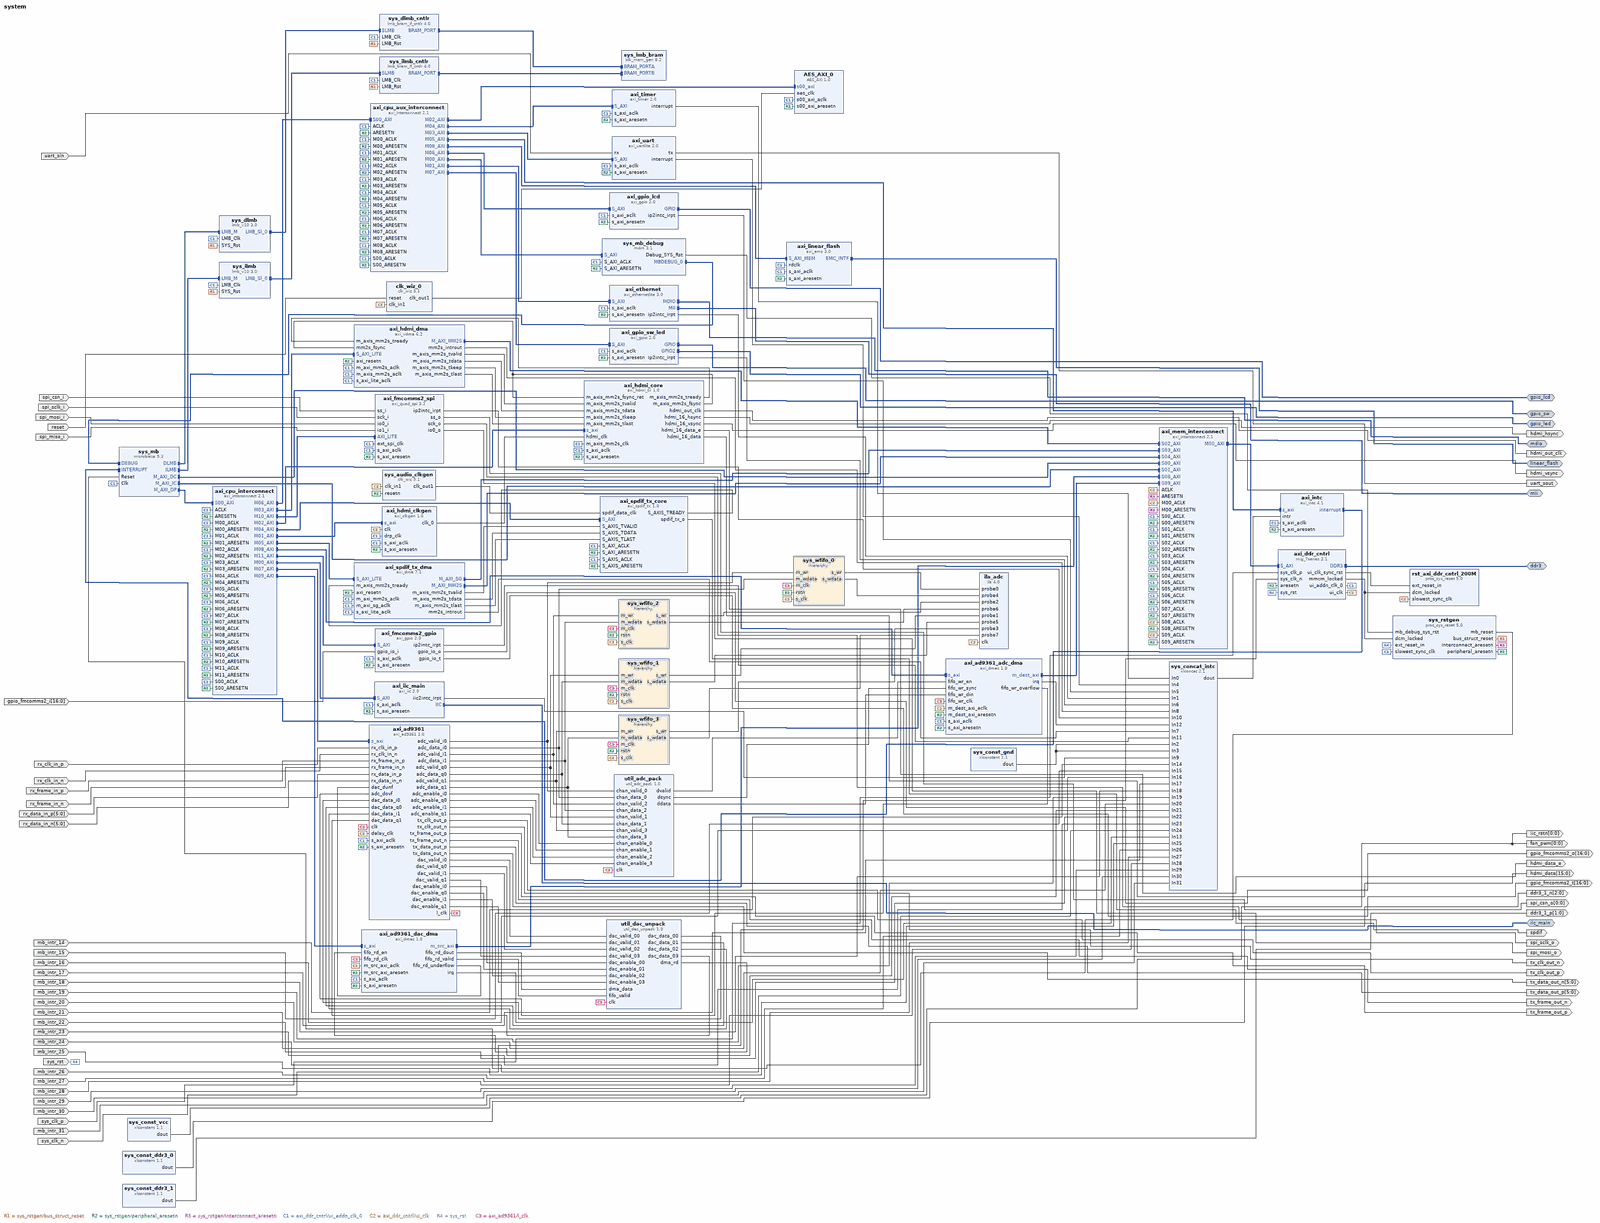
[diagram p0: block diagram of the top level, whole]
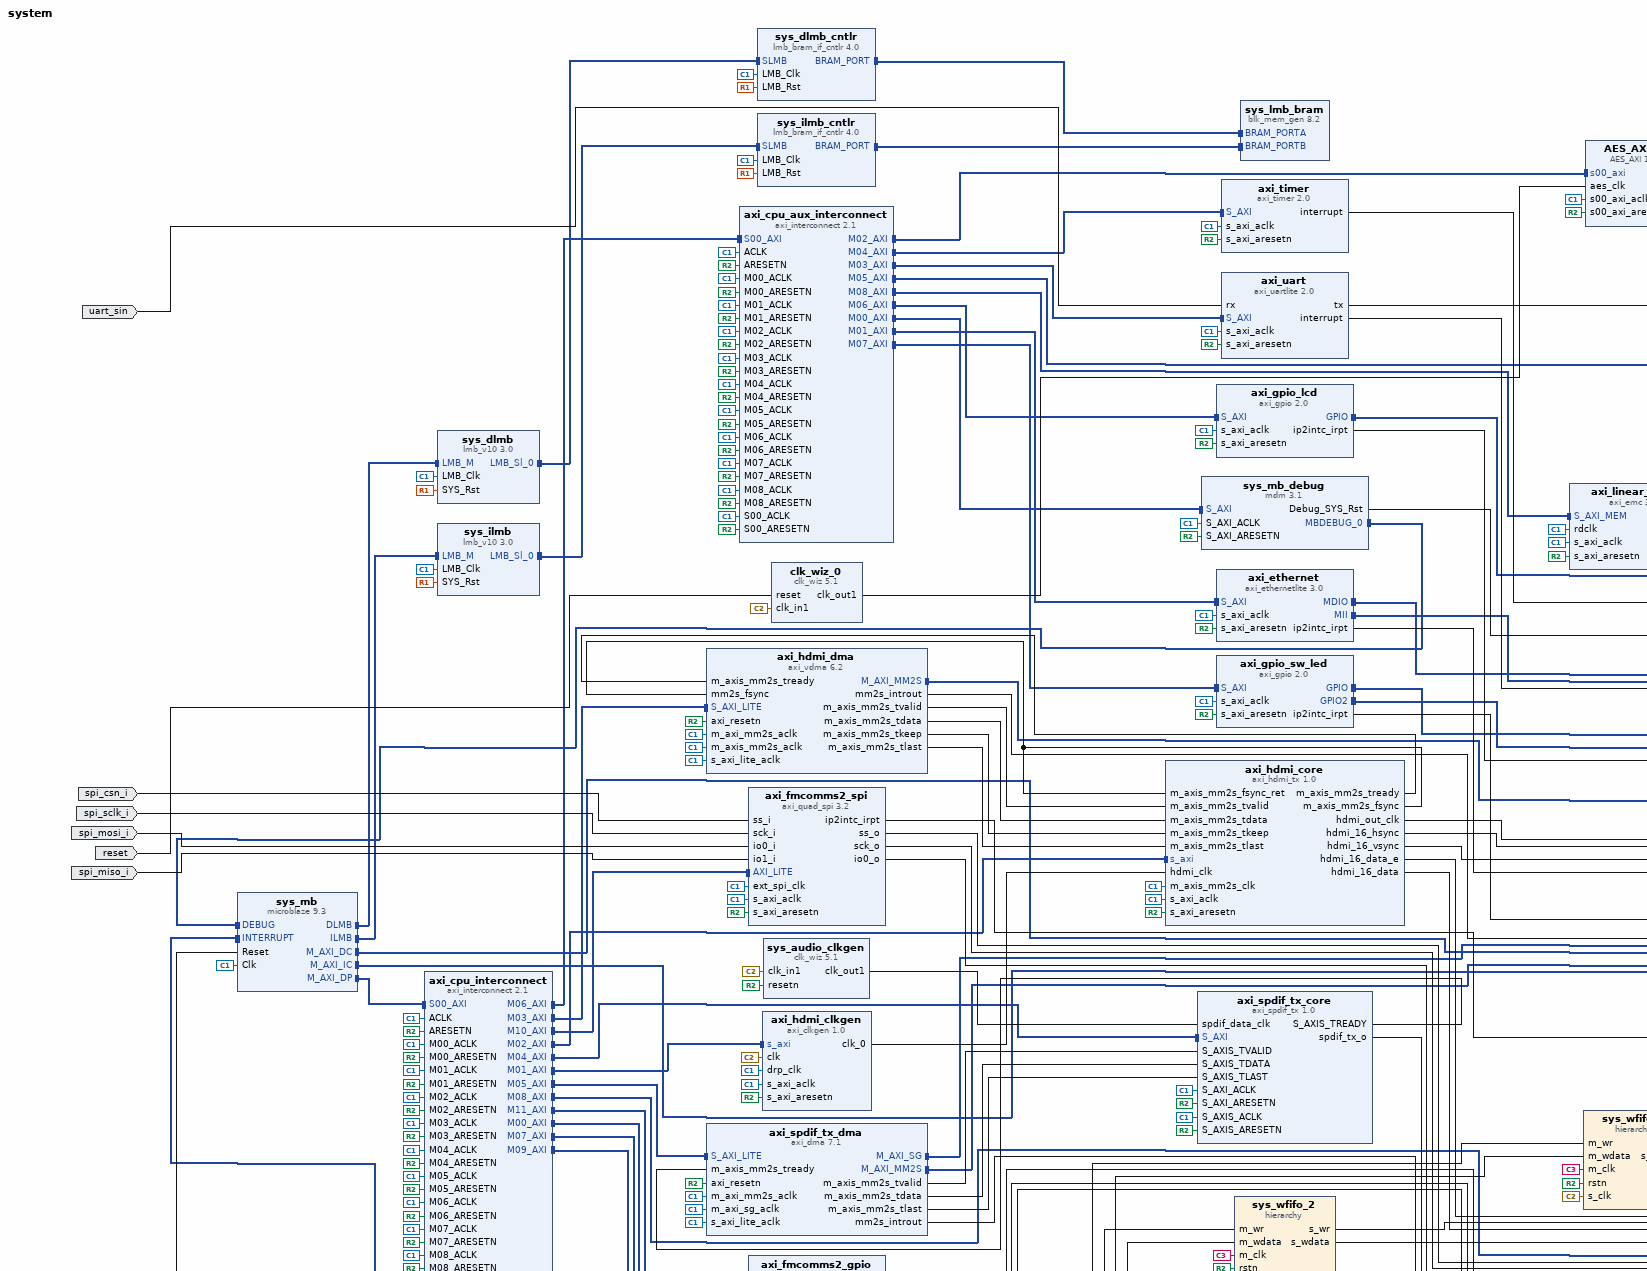
[diagram p1: block diagram of the top level, upper left part]
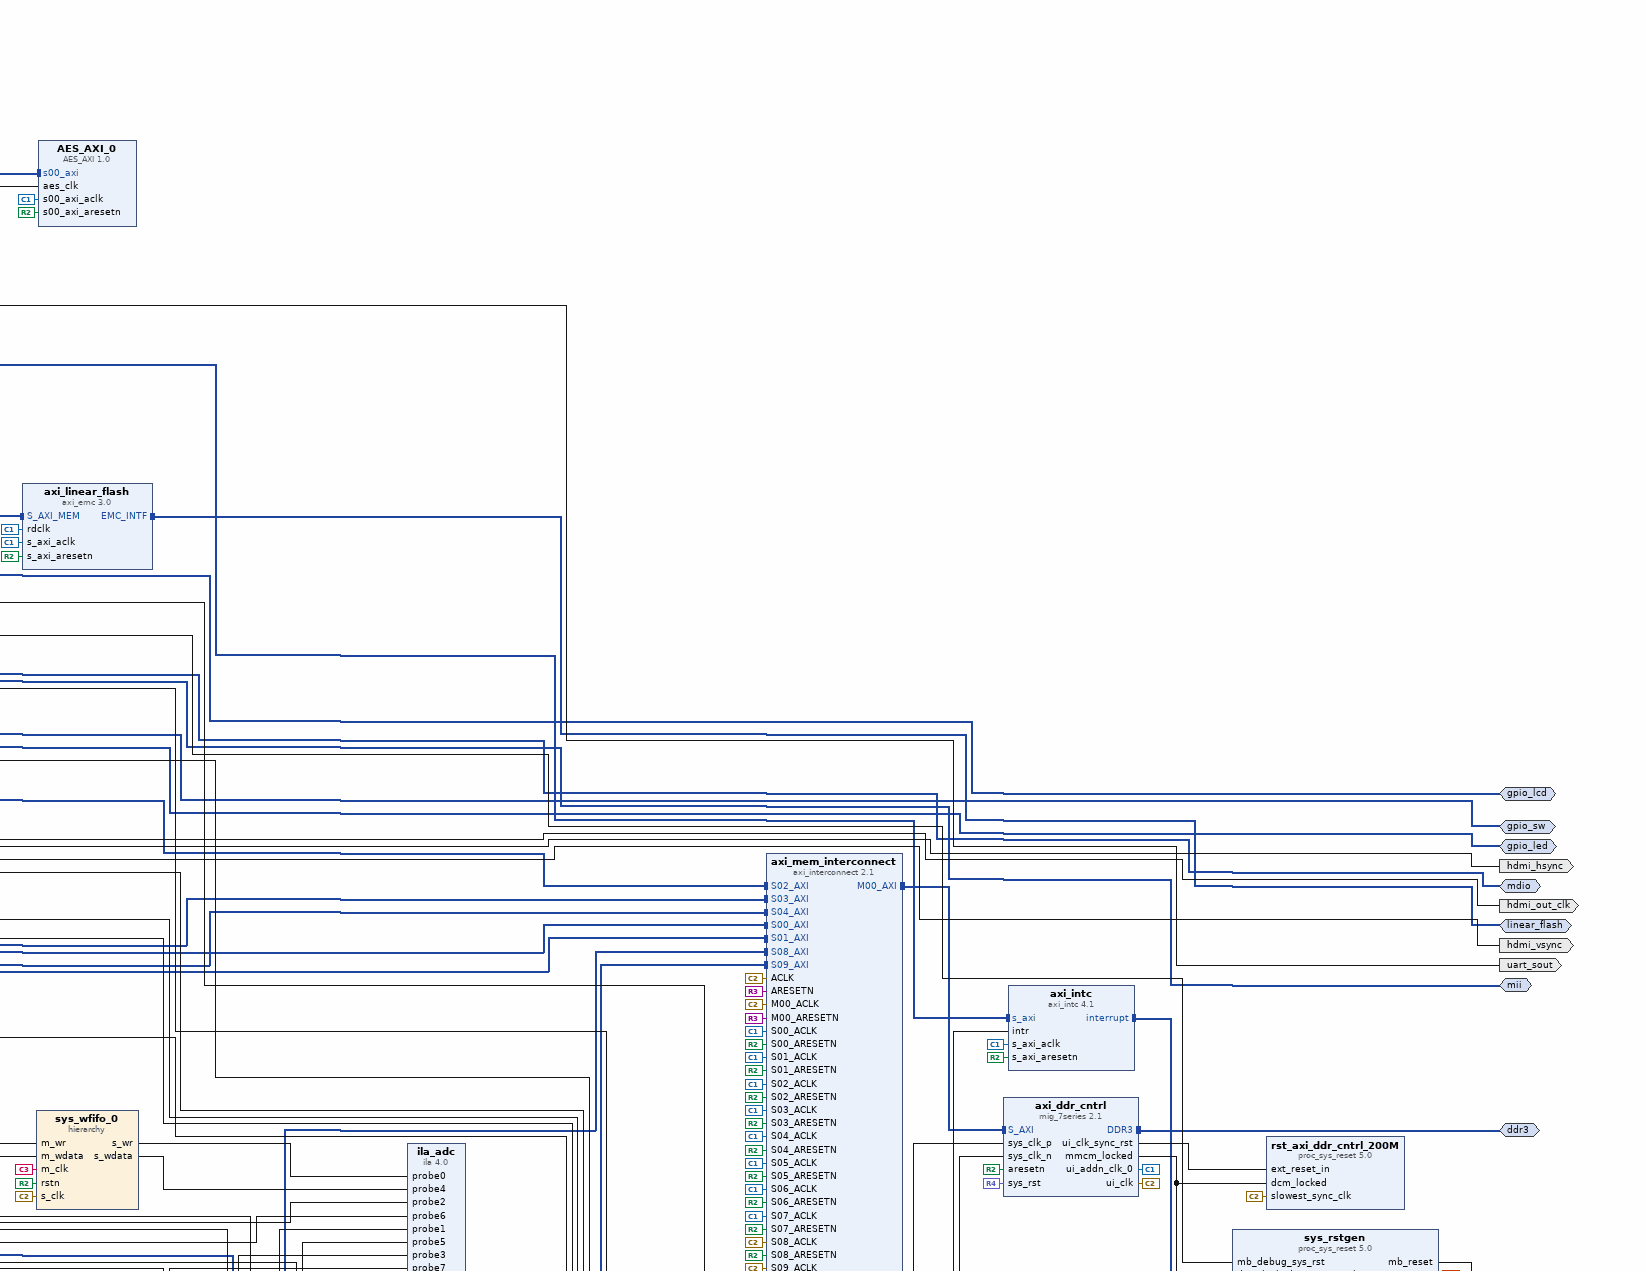
[diagram p2: block diagram of the top level, upper right part]
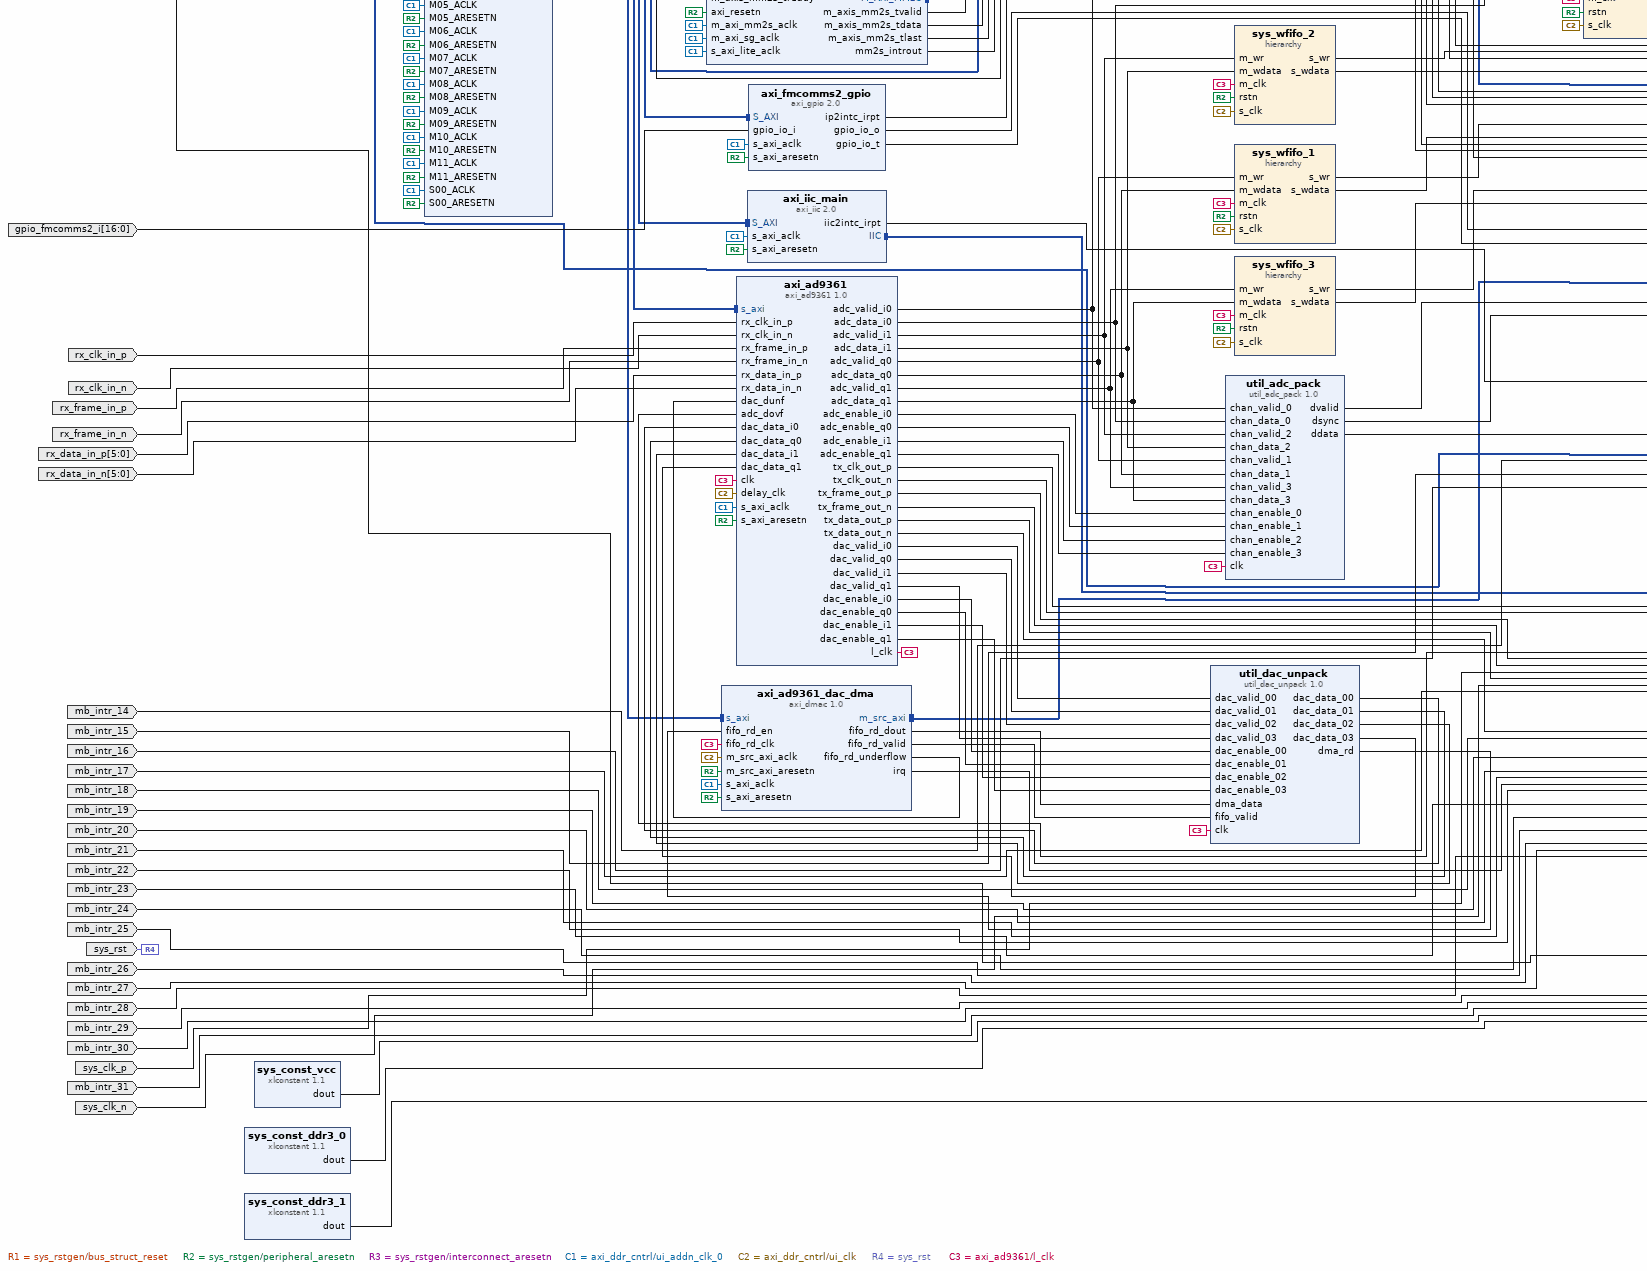
[diagram p3: block diagram of the top level, lower left part]
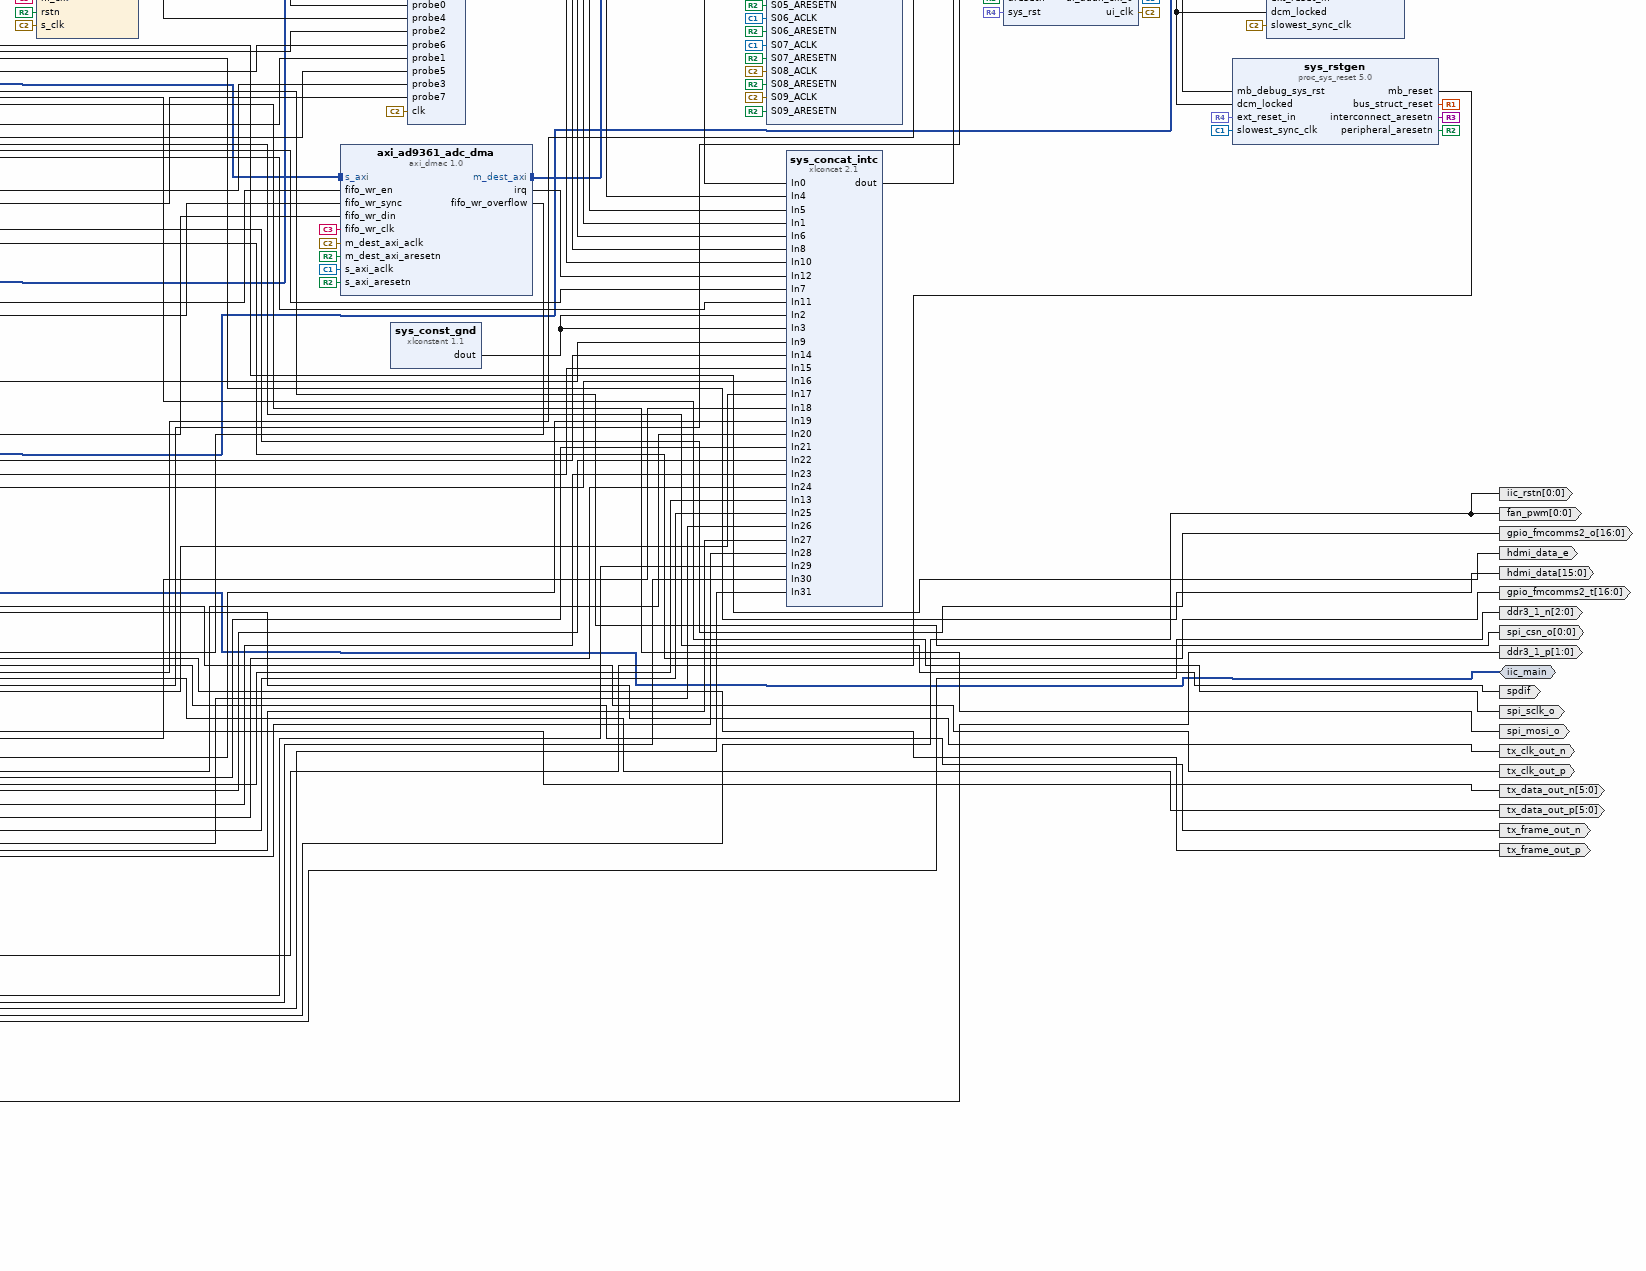
[diagram p4: block diagram of the top level, lower right part]
# Vivado block design system, Vivado 2014.2
create_bd_design system

create_bd_intf_port -mode Master -vlnv xilinx.com:interface:ddrx_rtl:1.0 ddr3
create_bd_intf_port -mode Master -vlnv xilinx.com:interface:mdio_rtl:1.0 mdio
create_bd_intf_port -mode Master -vlnv xilinx.com:interface:mii_rtl:1.0 mii
create_bd_intf_port -mode Master -vlnv xilinx.com:interface:gpio_rtl:1.0 gpio_sw
create_bd_intf_port -mode Master -vlnv xilinx.com:interface:gpio_rtl:1.0 gpio_led
create_bd_intf_port -mode Master -vlnv xilinx.com:interface:gpio_rtl:1.0 gpio_lcd
create_bd_intf_port -mode Master -vlnv xilinx.com:interface:iic_rtl:1.0 iic_main
create_bd_intf_port -mode Master -vlnv xilinx.com:interface:emc_rtl:1.0 linear_flash
create_bd_port -dir I -type intr mb_intr_14
create_bd_port -dir I -type intr mb_intr_15
create_bd_port -dir I -type intr mb_intr_16
create_bd_port -dir I -type intr mb_intr_17
create_bd_port -dir I -type intr mb_intr_18
create_bd_port -dir I -type intr mb_intr_19
create_bd_port -dir I -type intr mb_intr_20
create_bd_port -dir I -type intr mb_intr_21
create_bd_port -dir I -type intr mb_intr_22
create_bd_port -dir I -type intr mb_intr_23
create_bd_port -dir I -type intr mb_intr_24
create_bd_port -dir I -type intr mb_intr_25
create_bd_port -dir I -type intr mb_intr_26
create_bd_port -dir I -type intr mb_intr_27
create_bd_port -dir I -type intr mb_intr_28
create_bd_port -dir I -type intr mb_intr_29
create_bd_port -dir I -type intr mb_intr_30
create_bd_port -dir I -type intr mb_intr_31
create_bd_port -dir O -from 0 -to 0 iic_rstn
create_bd_port -dir O -from 0 -to 0 fan_pwm
create_bd_port -dir I -type rst sys_rst
set_property -dict {CONFIG.POLARITY ACTIVE_HIGH} [get_bd_ports sys_rst]
create_bd_port -dir I sys_clk_p
create_bd_port -dir I sys_clk_n
create_bd_port -dir O -from 2 -to 0 ddr3_1_n
create_bd_port -dir O -from 1 -to 0 ddr3_1_p
create_bd_port -dir I uart_sin
create_bd_port -dir O uart_sout
create_bd_port -dir O hdmi_out_clk
create_bd_port -dir O hdmi_hsync
create_bd_port -dir O hdmi_vsync
create_bd_port -dir O hdmi_data_e
create_bd_port -dir O -from 15 -to 0 hdmi_data
create_bd_port -dir O spdif
create_bd_port -dir I spi_csn_i
create_bd_port -dir O -from 0 -to 0 spi_csn_o
create_bd_port -dir I spi_sclk_i
create_bd_port -dir O spi_sclk_o
create_bd_port -dir I spi_mosi_i
create_bd_port -dir O spi_mosi_o
create_bd_port -dir I spi_miso_i
create_bd_port -dir I -from 16 -to 0 gpio_fmcomms2_i
create_bd_port -dir O -from 16 -to 0 gpio_fmcomms2_o
create_bd_port -dir O -from 16 -to 0 gpio_fmcomms2_t
create_bd_port -dir I rx_clk_in_p
create_bd_port -dir I rx_clk_in_n
create_bd_port -dir I rx_frame_in_p
create_bd_port -dir I rx_frame_in_n
create_bd_port -dir I -from 5 -to 0 rx_data_in_p
create_bd_port -dir I -from 5 -to 0 rx_data_in_n
create_bd_port -dir O tx_clk_out_p
create_bd_port -dir O tx_clk_out_n
create_bd_port -dir O tx_frame_out_p
create_bd_port -dir O tx_frame_out_n
create_bd_port -dir O -from 5 -to 0 tx_data_out_p
create_bd_port -dir O -from 5 -to 0 tx_data_out_n
create_bd_port -dir I -type rst reset
set_property -dict {CONFIG.POLARITY ACTIVE_HIGH} [get_bd_ports reset]

create_bd_cell -type ip -vlnv xilinx.com:ip:microblaze:9.3 sys_mb
set_property -dict {CONFIG.G_TEMPLATE_LIST 4} [get_bd_cells sys_mb]
create_bd_cell -type ip -vlnv xilinx.com:ip:lmb_v10:3.0 sys_dlmb
create_bd_cell -type ip -vlnv xilinx.com:ip:lmb_v10:3.0 sys_ilmb
create_bd_cell -type ip -vlnv xilinx.com:ip:lmb_bram_if_cntlr:4.0 sys_dlmb_cntlr
set_property -dict {CONFIG.C_ECC 0} [get_bd_cells sys_dlmb_cntlr]
create_bd_cell -type ip -vlnv xilinx.com:ip:lmb_bram_if_cntlr:4.0 sys_ilmb_cntlr
set_property -dict {CONFIG.C_ECC 0} [get_bd_cells sys_ilmb_cntlr]
create_bd_cell -type ip -vlnv xilinx.com:ip:blk_mem_gen:8.2 sys_lmb_bram
set_property -dict {CONFIG.Memory_Type True_Dual_Port_RAM CONFIG.use_bram_block BRAM_Controller} [get_bd_cells sys_lmb_bram]
create_bd_cell -type ip -vlnv xilinx.com:ip:mdm:3.1 sys_mb_debug
set_property -dict {CONFIG.C_USE_UART 1} [get_bd_cells sys_mb_debug]
create_bd_cell -type ip -vlnv xilinx.com:ip:proc_sys_reset:5.0 sys_rstgen
create_bd_cell -type ip -vlnv xilinx.com:ip:xlconstant:1.1 sys_const_vcc
create_bd_cell -type ip -vlnv xilinx.com:ip:xlconstant:1.1 sys_const_gnd
set_property -dict {CONFIG.CONST_VAL 0} [get_bd_cells sys_const_gnd]
create_bd_cell -type ip -vlnv xilinx.com:ip:mig_7series:2.1 axi_ddr_cntrl
set_property -dict {CONFIG.XML_INPUT_FILE kc705_system_mig.prj} [get_bd_cells axi_ddr_cntrl]
create_bd_cell -type ip -vlnv xilinx.com:ip:xlconstant:1.1 sys_const_ddr3_0
set_property -dict {CONFIG.CONST_WIDTH 3 CONFIG.CONST_VAL 0} [get_bd_cells sys_const_ddr3_0]
create_bd_cell -type ip -vlnv xilinx.com:ip:xlconstant:1.1 sys_const_ddr3_1
set_property -dict {CONFIG.CONST_WIDTH 2 CONFIG.CONST_VAL 1} [get_bd_cells sys_const_ddr3_1]
create_bd_cell -type ip -vlnv xilinx.com:ip:axi_interconnect:2.1 axi_cpu_aux_interconnect
set_property -dict {CONFIG.NUM_MI 9 CONFIG.STRATEGY 1} [get_bd_cells axi_cpu_aux_interconnect]
create_bd_cell -type ip -vlnv xilinx.com:ip:axi_interconnect:2.1 axi_cpu_interconnect
set_property -dict {CONFIG.NUM_MI 12 CONFIG.STRATEGY 1} [get_bd_cells axi_cpu_interconnect]
create_bd_cell -type ip -vlnv xilinx.com:ip:axi_interconnect:2.1 axi_mem_interconnect
set_property -dict [list \
  CONFIG.NUM_SI 10 \
  CONFIG.NUM_MI 1 \
  CONFIG.STRATEGY 2 \
  CONFIG.ENABLE_ADVANCED_OPTIONS 1 \
  CONFIG.XBAR_DATA_WIDTH 512 \
] [get_bd_cells axi_mem_interconnect]
create_bd_cell -type ip -vlnv xilinx.com:ip:axi_ethernetlite:3.0 axi_ethernet
set_property -dict [list \
  CONFIG.USE_BOARD_FLOW true \
  CONFIG.MII_BOARD_INTERFACE mii \
  CONFIG.MDIO_BOARD_INTERFACE mdio_mdc \
] [get_bd_cells axi_ethernet]
create_bd_cell -type ip -vlnv xilinx.com:ip:axi_iic:2.0 axi_iic_main
create_bd_cell -type ip -vlnv xilinx.com:ip:axi_uartlite:2.0 axi_uart
set_property -dict {CONFIG.C_BAUDRATE 115200} [get_bd_cells axi_uart]
create_bd_cell -type ip -vlnv xilinx.com:ip:axi_timer:2.0 axi_timer
create_bd_cell -type ip -vlnv xilinx.com:ip:axi_gpio:2.0 axi_gpio_lcd
set_property -dict {CONFIG.C_GPIO_WIDTH 7 CONFIG.C_INTERRUPT_PRESENT 1} [get_bd_cells axi_gpio_lcd]
create_bd_cell -type ip -vlnv xilinx.com:ip:axi_gpio:2.0 axi_gpio_sw_led
set_property -dict [list \
  CONFIG.C_GPIO_WIDTH 9 \
  CONFIG.C_GPIO2_WIDTH 8 \
  CONFIG.C_IS_DUAL 1 \
  CONFIG.C_INTERRUPT_PRESENT 1 \
] [get_bd_cells axi_gpio_sw_led]
create_bd_cell -type ip -vlnv xilinx.com:ip:axi_intc:4.1 axi_intc
set_property -dict {CONFIG.C_HAS_FAST 0} [get_bd_cells axi_intc]
create_bd_cell -type ip -vlnv xilinx.com:ip:xlconcat:2.1 sys_concat_intc
set_property -dict {CONFIG.NUM_PORTS 32} [get_bd_cells sys_concat_intc]
create_bd_cell -type ip -vlnv analog.com:user:axi_clkgen:1.0 axi_hdmi_clkgen
create_bd_cell -type ip -vlnv analog.com:user:axi_hdmi_tx:1.0 axi_hdmi_core
create_bd_cell -type ip -vlnv xilinx.com:ip:axi_vdma:6.2 axi_hdmi_dma
set_property -dict [list \
  CONFIG.c_m_axis_mm2s_tdata_width 64 \
  CONFIG.c_use_mm2s_fsync 1 \
  CONFIG.c_include_s2mm 0 \
] [get_bd_cells axi_hdmi_dma]
create_bd_cell -type ip -vlnv xilinx.com:ip:clk_wiz:5.1 sys_audio_clkgen
set_property -dict [list \
  CONFIG.PRIM_IN_FREQ 200.000 \
  CONFIG.CLKOUT1_REQUESTED_OUT_FREQ 12.288 \
  CONFIG.USE_LOCKED false \
  CONFIG.USE_RESET true \
  CONFIG.RESET_TYPE ACTIVE_LOW \
] [get_bd_cells sys_audio_clkgen]
create_bd_cell -type ip -vlnv analog.com:user:axi_spdif_tx:1.0 axi_spdif_tx_core
set_property -dict {CONFIG.C_DMA_TYPE 0 CONFIG.C_S_AXI_ADDR_WIDTH 16} [get_bd_cells axi_spdif_tx_core]
create_bd_cell -type ip -vlnv xilinx.com:ip:axi_dma:7.1 axi_spdif_tx_dma
set_property -dict {CONFIG.c_sg_include_stscntrl_strm 0 CONFIG.c_include_s2mm 0} [get_bd_cells axi_spdif_tx_dma]
create_bd_cell -type ip -vlnv xilinx.com:ip:axi_emc:3.0 axi_linear_flash
set_property -dict [list \
  CONFIG.C_WR_REC_TIME_MEM_0 0 \
  CONFIG.C_TLZWE_PS_MEM_0 0 \
  CONFIG.C_TWPH_PS_MEM_0 20000 \
  CONFIG.C_TWP_PS_MEM_0 50000 \
  CONFIG.C_TWC_PS_MEM_0 19000 \
  CONFIG.C_THZOE_PS_MEM_0 15000 \
  CONFIG.C_THZCE_PS_MEM_0 20000 \
  CONFIG.C_TPACC_PS_FLASH_0 25000 \
  CONFIG.C_TAVDV_PS_MEM_0 100000 \
  CONFIG.C_TCEDV_PS_MEM_0 100000 \
  CONFIG.C_MEM0_TYPE 2 \
  CONFIG.C_S_AXI_MEM_ID_WIDTH 0 \
  CONFIG.USE_BOARD_FLOW true \
  CONFIG.EMC_BOARD_INTERFACE linear_flash \
] [get_bd_cells axi_linear_flash]
create_bd_cell -type ip -vlnv analog.com:user:axi_ad9361:1.0 axi_ad9361
set_property -dict {CONFIG.PCORE_ID 0} [get_bd_cells axi_ad9361]
create_bd_cell -type ip -vlnv analog.com:user:axi_dmac:1.0 axi_ad9361_dac_dma
set_property -dict [list \
  CONFIG.C_DMA_TYPE_SRC 0 \
  CONFIG.C_DMA_TYPE_DEST 2 \
  CONFIG.C_CYCLIC 1 \
  CONFIG.C_SYNC_TRANSFER_START 0 \
  CONFIG.C_AXI_SLICE_SRC 0 \
  CONFIG.C_AXI_SLICE_DEST 1 \
  CONFIG.C_CLKS_ASYNC_DEST_REQ 1 \
  CONFIG.C_CLKS_ASYNC_SRC_DEST 1 \
  CONFIG.C_CLKS_ASYNC_REQ_SRC 1 \
  CONFIG.C_2D_TRANSFER 0 \
  CONFIG.C_DMA_DATA_WIDTH_DEST 64 \
] [get_bd_cells axi_ad9361_dac_dma]
create_bd_cell -type ip -vlnv analog.com:user:util_adc_pack:1.0 util_adc_pack
set_property -dict {CONFIG.CHANNELS 4} [get_bd_cells util_adc_pack]
create_bd_cell -type ip -vlnv analog.com:user:util_dac_unpack:1.0 util_dac_unpack
set_property -dict {CONFIG.CHANNELS 4} [get_bd_cells util_dac_unpack]
create_bd_cell -type ip -vlnv analog.com:user:axi_dmac:1.0 axi_ad9361_adc_dma
set_property -dict [list \
  CONFIG.C_DMA_TYPE_SRC 2 \
  CONFIG.C_DMA_TYPE_DEST 0 \
  CONFIG.C_CYCLIC 0 \
  CONFIG.C_SYNC_TRANSFER_START 1 \
  CONFIG.C_AXI_SLICE_SRC 0 \
  CONFIG.C_AXI_SLICE_DEST 0 \
  CONFIG.C_CLKS_ASYNC_DEST_REQ 1 \
  CONFIG.C_CLKS_ASYNC_SRC_DEST 1 \
  CONFIG.C_CLKS_ASYNC_REQ_SRC 1 \
  CONFIG.C_2D_TRANSFER 0 \
  CONFIG.C_DMA_DATA_WIDTH_SRC 64 \
] [get_bd_cells axi_ad9361_adc_dma]
create_bd_cell -type ip -vlnv xilinx.com:ip:axi_quad_spi:3.2 axi_fmcomms2_spi
set_property -dict {CONFIG.C_USE_STARTUP 0 CONFIG.C_NUM_SS_BITS 1 CONFIG.C_SCK_RATIO 8} [get_bd_cells axi_fmcomms2_spi]
create_bd_cell -type ip -vlnv xilinx.com:ip:axi_gpio:2.0 axi_fmcomms2_gpio
set_property -dict {CONFIG.C_GPIO_WIDTH 17 CONFIG.C_IS_DUAL 0 CONFIG.C_INTERRUPT_PRESENT 1} [get_bd_cells axi_fmcomms2_gpio]
create_bd_cell -type ip -vlnv xilinx.com:ip:ila:4.0 ila_adc
set_property -dict [list \
  CONFIG.C_PROBE7_WIDTH 16 \
  CONFIG.C_PROBE6_WIDTH 16 \
  CONFIG.C_PROBE5_WIDTH 16 \
  CONFIG.C_PROBE4_WIDTH 16 \
  CONFIG.C_PROBE3_WIDTH 1 \
  CONFIG.C_PROBE2_WIDTH 1 \
  CONFIG.C_PROBE1_WIDTH 1 \
  CONFIG.C_PROBE0_WIDTH 1 \
  CONFIG.C_NUM_OF_PROBES 8 \
  CONFIG.C_EN_STRG_QUAL 1 \
  CONFIG.C_TRIGIN_EN false \
  CONFIG.C_MONITOR_TYPE Native \
] [get_bd_cells ila_adc]
create_bd_cell -type hier sys_wfifo_0
create_bd_cell -type hier sys_wfifo_1
create_bd_cell -type hier sys_wfifo_2
create_bd_cell -type hier sys_wfifo_3
create_bd_cell -type ip -vlnv xilinx.com:ip:proc_sys_reset:5.0 rst_axi_ddr_cntrl_200M
create_bd_cell -type ip -vlnv xilinx.com:ip:clk_wiz:5.1 clk_wiz_0
set_property -dict [list \
  CONFIG.CLKOUT1_REQUESTED_OUT_FREQ 64.000 \
  CONFIG.USE_LOCKED false \
  CONFIG.USE_BOARD_FLOW true \
  CONFIG.RESET_BOARD_INTERFACE reset \
] [get_bd_cells clk_wiz_0]
create_bd_cell -type ip -vlnv CGMA:user:AES_AXI:1.0 AES_AXI_0

# ---- hierarchy /sys_wfifo_0 ----
current_bd_instance /sys_wfifo_0
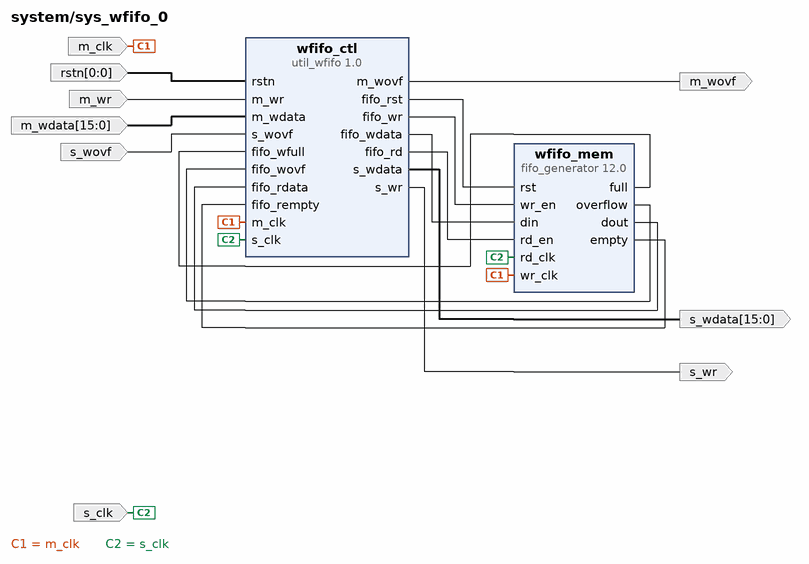
[diagram p5: block diagram inside /sys_wfifo_0]
create_bd_pin -dir I -from 0 -to 0 rstn
create_bd_pin -dir I -type clk m_clk
create_bd_pin -dir I m_wr
create_bd_pin -dir O m_wovf
create_bd_pin -dir I -from 15 -to 0 m_wdata
create_bd_pin -dir I -type clk s_clk
create_bd_pin -dir O s_wr
create_bd_pin -dir I s_wovf
create_bd_pin -dir O -from 15 -to 0 s_wdata

create_bd_cell -type ip -vlnv analog.com:user:util_wfifo:1.0 wfifo_ctl
set_property -dict {CONFIG.S_DATA_WIDTH 16 CONFIG.M_DATA_WIDTH 16} [get_bd_cells wfifo_ctl]
create_bd_cell -type ip -vlnv xilinx.com:ip:fifo_generator:12.0 wfifo_mem
set_property -dict [list \
  CONFIG.Fifo_Implementation Independent_Clocks_Block_RAM \
  CONFIG.INTERFACE_TYPE Native \
  CONFIG.Input_Data_Width 16 \
  CONFIG.Input_Depth 64 \
  CONFIG.Output_Data_Width 16 \
  CONFIG.Overflow_Flag true \
] [get_bd_cells wfifo_mem]

# ---- hierarchy /sys_wfifo_1 ----
current_bd_instance /sys_wfifo_1
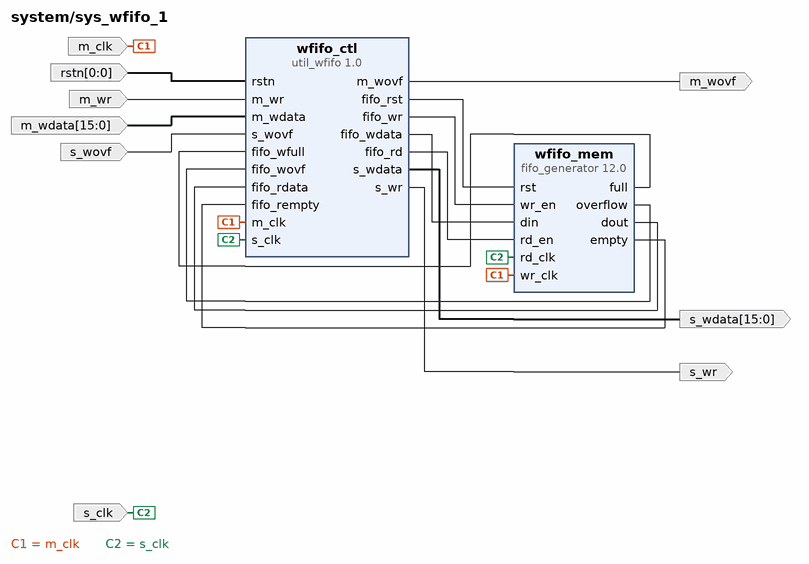
[diagram p6: block diagram inside /sys_wfifo_1]
create_bd_pin -dir I -from 0 -to 0 rstn
create_bd_pin -dir I -type clk m_clk
create_bd_pin -dir I m_wr
create_bd_pin -dir O m_wovf
create_bd_pin -dir I -from 15 -to 0 m_wdata
create_bd_pin -dir I -type clk s_clk
create_bd_pin -dir O s_wr
create_bd_pin -dir I s_wovf
create_bd_pin -dir O -from 15 -to 0 s_wdata

create_bd_cell -type ip -vlnv analog.com:user:util_wfifo:1.0 wfifo_ctl
set_property -dict {CONFIG.S_DATA_WIDTH 16 CONFIG.M_DATA_WIDTH 16} [get_bd_cells wfifo_ctl]
create_bd_cell -type ip -vlnv xilinx.com:ip:fifo_generator:12.0 wfifo_mem
set_property -dict [list \
  CONFIG.Fifo_Implementation Independent_Clocks_Block_RAM \
  CONFIG.INTERFACE_TYPE Native \
  CONFIG.Input_Data_Width 16 \
  CONFIG.Input_Depth 64 \
  CONFIG.Output_Data_Width 16 \
  CONFIG.Overflow_Flag true \
] [get_bd_cells wfifo_mem]

# ---- hierarchy /sys_wfifo_2 ----
current_bd_instance /sys_wfifo_2
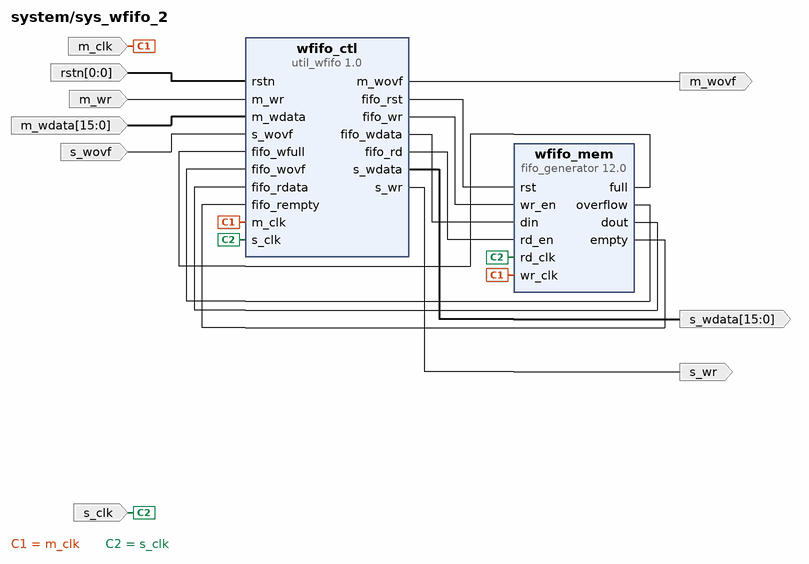
[diagram p7: block diagram inside /sys_wfifo_2]
create_bd_pin -dir I -from 0 -to 0 rstn
create_bd_pin -dir I -type clk m_clk
create_bd_pin -dir I m_wr
create_bd_pin -dir O m_wovf
create_bd_pin -dir I -from 15 -to 0 m_wdata
create_bd_pin -dir I -type clk s_clk
create_bd_pin -dir O s_wr
create_bd_pin -dir I s_wovf
create_bd_pin -dir O -from 15 -to 0 s_wdata

create_bd_cell -type ip -vlnv analog.com:user:util_wfifo:1.0 wfifo_ctl
set_property -dict {CONFIG.S_DATA_WIDTH 16 CONFIG.M_DATA_WIDTH 16} [get_bd_cells wfifo_ctl]
create_bd_cell -type ip -vlnv xilinx.com:ip:fifo_generator:12.0 wfifo_mem
set_property -dict [list \
  CONFIG.Fifo_Implementation Independent_Clocks_Block_RAM \
  CONFIG.INTERFACE_TYPE Native \
  CONFIG.Input_Data_Width 16 \
  CONFIG.Input_Depth 64 \
  CONFIG.Output_Data_Width 16 \
  CONFIG.Overflow_Flag true \
] [get_bd_cells wfifo_mem]

# ---- hierarchy /sys_wfifo_3 ----
current_bd_instance /sys_wfifo_3
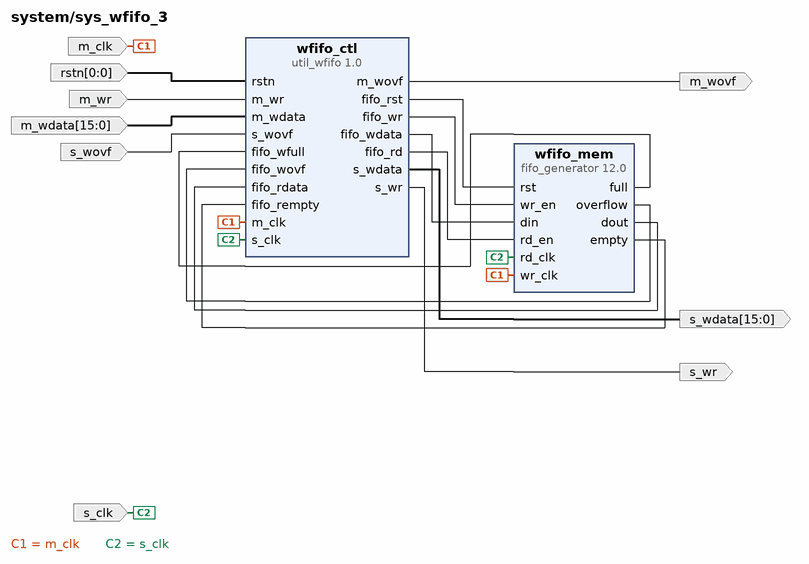
[diagram p8: block diagram inside /sys_wfifo_3]
create_bd_pin -dir I -from 0 -to 0 rstn
create_bd_pin -dir I -type clk m_clk
create_bd_pin -dir I m_wr
create_bd_pin -dir O m_wovf
create_bd_pin -dir I -from 15 -to 0 m_wdata
create_bd_pin -dir I -type clk s_clk
create_bd_pin -dir O s_wr
create_bd_pin -dir I s_wovf
create_bd_pin -dir O -from 15 -to 0 s_wdata

create_bd_cell -type ip -vlnv analog.com:user:util_wfifo:1.0 wfifo_ctl
set_property -dict {CONFIG.S_DATA_WIDTH 16 CONFIG.M_DATA_WIDTH 16} [get_bd_cells wfifo_ctl]
create_bd_cell -type ip -vlnv xilinx.com:ip:fifo_generator:12.0 wfifo_mem
set_property -dict [list \
  CONFIG.Fifo_Implementation Independent_Clocks_Block_RAM \
  CONFIG.INTERFACE_TYPE Native \
  CONFIG.Input_Data_Width 16 \
  CONFIG.Input_Depth 64 \
  CONFIG.Output_Data_Width 16 \
  CONFIG.Overflow_Flag true \
] [get_bd_cells wfifo_mem]

# ---- connections ----

current_bd_instance /sys_wfifo_0
connect_bd_net [get_bd_pins rstn] [get_bd_pins wfifo_ctl/rstn]
connect_bd_net [get_bd_pins m_clk] [get_bd_pins wfifo_ctl/m_clk] [get_bd_pins wfifo_mem/wr_clk]
connect_bd_net [get_bd_pins s_clk] [get_bd_pins wfifo_ctl/s_clk] [get_bd_pins wfifo_mem/rd_clk]
connect_bd_net [get_bd_pins m_wr] [get_bd_pins wfifo_ctl/m_wr]
connect_bd_net [get_bd_pins m_wdata] [get_bd_pins wfifo_ctl/m_wdata]
connect_bd_net -net m_wovf [get_bd_pins wfifo_ctl/m_wovf] [get_bd_pins m_wovf]
connect_bd_net -net s_wr [get_bd_pins wfifo_ctl/s_wr] [get_bd_pins s_wr]
connect_bd_net -net s_wdata [get_bd_pins wfifo_ctl/s_wdata] [get_bd_pins s_wdata]
connect_bd_net [get_bd_pins s_wovf] [get_bd_pins wfifo_ctl/s_wovf]
connect_bd_net [get_bd_pins wfifo_ctl/fifo_rst] [get_bd_pins wfifo_mem/rst]
connect_bd_net [get_bd_pins wfifo_ctl/fifo_wr] [get_bd_pins wfifo_mem/wr_en]
connect_bd_net [get_bd_pins wfifo_ctl/fifo_wdata] [get_bd_pins wfifo_mem/din]
connect_bd_net -net wfifo_ctl_fifo_wfull [get_bd_pins wfifo_mem/full] [get_bd_pins wfifo_ctl/fifo_wfull]
connect_bd_net -net wfifo_ctl_fifo_wovf [get_bd_pins wfifo_mem/overflow] [get_bd_pins wfifo_ctl/fifo_wovf]
connect_bd_net [get_bd_pins wfifo_ctl/fifo_rd] [get_bd_pins wfifo_mem/rd_en]
connect_bd_net -net wfifo_ctl_fifo_rdata [get_bd_pins wfifo_mem/dout] [get_bd_pins wfifo_ctl/fifo_rdata]
connect_bd_net -net wfifo_ctl_fifo_rempty [get_bd_pins wfifo_mem/empty] [get_bd_pins wfifo_ctl/fifo_rempty]

current_bd_instance /sys_wfifo_1
connect_bd_net [get_bd_pins rstn] [get_bd_pins wfifo_ctl/rstn]
connect_bd_net [get_bd_pins m_clk] [get_bd_pins wfifo_ctl/m_clk] [get_bd_pins wfifo_mem/wr_clk]
connect_bd_net [get_bd_pins s_clk] [get_bd_pins wfifo_ctl/s_clk] [get_bd_pins wfifo_mem/rd_clk]
connect_bd_net [get_bd_pins m_wr] [get_bd_pins wfifo_ctl/m_wr]
connect_bd_net [get_bd_pins m_wdata] [get_bd_pins wfifo_ctl/m_wdata]
connect_bd_net -net m_wovf [get_bd_pins wfifo_ctl/m_wovf] [get_bd_pins m_wovf]
connect_bd_net -net s_wr [get_bd_pins wfifo_ctl/s_wr] [get_bd_pins s_wr]
connect_bd_net -net s_wdata [get_bd_pins wfifo_ctl/s_wdata] [get_bd_pins s_wdata]
connect_bd_net [get_bd_pins s_wovf] [get_bd_pins wfifo_ctl/s_wovf]
connect_bd_net [get_bd_pins wfifo_ctl/fifo_rst] [get_bd_pins wfifo_mem/rst]
connect_bd_net [get_bd_pins wfifo_ctl/fifo_wr] [get_bd_pins wfifo_mem/wr_en]
connect_bd_net [get_bd_pins wfifo_ctl/fifo_wdata] [get_bd_pins wfifo_mem/din]
connect_bd_net -net wfifo_ctl_fifo_wfull [get_bd_pins wfifo_mem/full] [get_bd_pins wfifo_ctl/fifo_wfull]
connect_bd_net -net wfifo_ctl_fifo_wovf [get_bd_pins wfifo_mem/overflow] [get_bd_pins wfifo_ctl/fifo_wovf]
connect_bd_net [get_bd_pins wfifo_ctl/fifo_rd] [get_bd_pins wfifo_mem/rd_en]
connect_bd_net -net wfifo_ctl_fifo_rdata [get_bd_pins wfifo_mem/dout] [get_bd_pins wfifo_ctl/fifo_rdata]
connect_bd_net -net wfifo_ctl_fifo_rempty [get_bd_pins wfifo_mem/empty] [get_bd_pins wfifo_ctl/fifo_rempty]

current_bd_instance /sys_wfifo_2
connect_bd_net [get_bd_pins rstn] [get_bd_pins wfifo_ctl/rstn]
connect_bd_net [get_bd_pins m_clk] [get_bd_pins wfifo_ctl/m_clk] [get_bd_pins wfifo_mem/wr_clk]
connect_bd_net [get_bd_pins s_clk] [get_bd_pins wfifo_ctl/s_clk] [get_bd_pins wfifo_mem/rd_clk]
connect_bd_net [get_bd_pins m_wr] [get_bd_pins wfifo_ctl/m_wr]
connect_bd_net [get_bd_pins m_wdata] [get_bd_pins wfifo_ctl/m_wdata]
connect_bd_net -net m_wovf [get_bd_pins wfifo_ctl/m_wovf] [get_bd_pins m_wovf]
connect_bd_net -net s_wr [get_bd_pins wfifo_ctl/s_wr] [get_bd_pins s_wr]
connect_bd_net -net s_wdata [get_bd_pins wfifo_ctl/s_wdata] [get_bd_pins s_wdata]
connect_bd_net [get_bd_pins s_wovf] [get_bd_pins wfifo_ctl/s_wovf]
connect_bd_net [get_bd_pins wfifo_ctl/fifo_rst] [get_bd_pins wfifo_mem/rst]
connect_bd_net [get_bd_pins wfifo_ctl/fifo_wr] [get_bd_pins wfifo_mem/wr_en]
connect_bd_net [get_bd_pins wfifo_ctl/fifo_wdata] [get_bd_pins wfifo_mem/din]
connect_bd_net -net wfifo_ctl_fifo_wfull [get_bd_pins wfifo_mem/full] [get_bd_pins wfifo_ctl/fifo_wfull]
connect_bd_net -net wfifo_ctl_fifo_wovf [get_bd_pins wfifo_mem/overflow] [get_bd_pins wfifo_ctl/fifo_wovf]
connect_bd_net [get_bd_pins wfifo_ctl/fifo_rd] [get_bd_pins wfifo_mem/rd_en]
connect_bd_net -net wfifo_ctl_fifo_rdata [get_bd_pins wfifo_mem/dout] [get_bd_pins wfifo_ctl/fifo_rdata]
connect_bd_net -net wfifo_ctl_fifo_rempty [get_bd_pins wfifo_mem/empty] [get_bd_pins wfifo_ctl/fifo_rempty]

current_bd_instance /sys_wfifo_3
connect_bd_net [get_bd_pins rstn] [get_bd_pins wfifo_ctl/rstn]
connect_bd_net [get_bd_pins m_clk] [get_bd_pins wfifo_ctl/m_clk] [get_bd_pins wfifo_mem/wr_clk]
connect_bd_net [get_bd_pins s_clk] [get_bd_pins wfifo_ctl/s_clk] [get_bd_pins wfifo_mem/rd_clk]
connect_bd_net [get_bd_pins m_wr] [get_bd_pins wfifo_ctl/m_wr]
connect_bd_net [get_bd_pins m_wdata] [get_bd_pins wfifo_ctl/m_wdata]
connect_bd_net -net m_wovf [get_bd_pins wfifo_ctl/m_wovf] [get_bd_pins m_wovf]
connect_bd_net -net s_wr [get_bd_pins wfifo_ctl/s_wr] [get_bd_pins s_wr]
connect_bd_net -net s_wdata [get_bd_pins wfifo_ctl/s_wdata] [get_bd_pins s_wdata]
connect_bd_net [get_bd_pins s_wovf] [get_bd_pins wfifo_ctl/s_wovf]
connect_bd_net [get_bd_pins wfifo_ctl/fifo_rst] [get_bd_pins wfifo_mem/rst]
connect_bd_net [get_bd_pins wfifo_ctl/fifo_wr] [get_bd_pins wfifo_mem/wr_en]
connect_bd_net [get_bd_pins wfifo_ctl/fifo_wdata] [get_bd_pins wfifo_mem/din]
connect_bd_net -net wfifo_ctl_fifo_wfull [get_bd_pins wfifo_mem/full] [get_bd_pins wfifo_ctl/fifo_wfull]
connect_bd_net -net wfifo_ctl_fifo_wovf [get_bd_pins wfifo_mem/overflow] [get_bd_pins wfifo_ctl/fifo_wovf]
connect_bd_net [get_bd_pins wfifo_ctl/fifo_rd] [get_bd_pins wfifo_mem/rd_en]
connect_bd_net -net wfifo_ctl_fifo_rdata [get_bd_pins wfifo_mem/dout] [get_bd_pins wfifo_ctl/fifo_rdata]
connect_bd_net -net wfifo_ctl_fifo_rempty [get_bd_pins wfifo_mem/empty] [get_bd_pins wfifo_ctl/fifo_rempty]

current_bd_instance /
connect_bd_intf_net -intf_net lmb_cntlr_1_dlmb [get_bd_intf_pins sys_dlmb/LMB_Sl_0] [get_bd_intf_pins sys_dlmb_cntlr/SLMB]
connect_bd_intf_net -intf_net lmb_cntlr_1_ilmb [get_bd_intf_pins sys_ilmb/LMB_Sl_0] [get_bd_intf_pins sys_ilmb_cntlr/SLMB]
connect_bd_intf_net -intf_net lmb_cntlr_1_dlmb_bram [get_bd_intf_pins sys_dlmb_cntlr/BRAM_PORT] [get_bd_intf_pins sys_lmb_bram/BRAM_PORTA]
connect_bd_intf_net -intf_net lmb_cntlr_1_ilmb_bram [get_bd_intf_pins sys_ilmb_cntlr/BRAM_PORT] [get_bd_intf_pins sys_lmb_bram/BRAM_PORTB]
connect_bd_intf_net [get_bd_intf_pins sys_mb/DLMB] [get_bd_intf_pins sys_dlmb/LMB_M]
connect_bd_intf_net [get_bd_intf_pins sys_mb/ILMB] [get_bd_intf_pins sys_ilmb/LMB_M]
connect_bd_intf_net -intf_net sys_mb_debug_intf [get_bd_intf_pins sys_mb_debug/MBDEBUG_0] [get_bd_intf_pins sys_mb/DEBUG]
connect_bd_intf_net [get_bd_intf_pins axi_intc/interrupt] [get_bd_intf_pins sys_mb/INTERRUPT]
connect_bd_intf_net -intf_net axi_cpu_aux_interconnect_s00 [get_bd_intf_pins axi_cpu_aux_interconnect/S00_AXI] [get_bd_intf_pins axi_cpu_interconnect/M06_AXI]
connect_bd_intf_net -intf_net axi_cpu_aux_interconnect_m00 [get_bd_intf_pins axi_cpu_aux_interconnect/M00_AXI] [get_bd_intf_pins sys_mb_debug/S_AXI]
connect_bd_intf_net -intf_net axi_cpu_aux_interconnect_m01 [get_bd_intf_pins axi_cpu_aux_interconnect/M01_AXI] [get_bd_intf_pins axi_ethernet/S_AXI]
connect_bd_intf_net -intf_net axi_cpu_aux_interconnect_m03 [get_bd_intf_pins axi_cpu_aux_interconnect/M03_AXI] [get_bd_intf_pins axi_uart/S_AXI]
connect_bd_intf_net -intf_net axi_cpu_aux_interconnect_m04 [get_bd_intf_pins axi_cpu_aux_interconnect/M04_AXI] [get_bd_intf_pins axi_timer/S_AXI]
connect_bd_intf_net -intf_net axi_cpu_aux_interconnect_m05 [get_bd_intf_pins axi_cpu_aux_interconnect/M05_AXI] [get_bd_intf_pins axi_intc/s_axi]
connect_bd_intf_net -intf_net axi_cpu_aux_interconnect_m06 [get_bd_intf_pins axi_cpu_aux_interconnect/M06_AXI] [get_bd_intf_pins axi_gpio_lcd/S_AXI]
connect_bd_intf_net -intf_net axi_cpu_aux_interconnect_m07 [get_bd_intf_pins axi_cpu_aux_interconnect/M07_AXI] [get_bd_intf_pins axi_gpio_sw_led/S_AXI]
connect_bd_intf_net -intf_net axi_cpu_aux_interconnect_m08 [get_bd_intf_pins axi_cpu_aux_interconnect/M08_AXI] [get_bd_intf_pins axi_linear_flash/S_AXI_MEM]
connect_bd_intf_net -intf_net axi_cpu_interconnect_s00 [get_bd_intf_pins axi_cpu_interconnect/S00_AXI] [get_bd_intf_pins sys_mb/M_AXI_DP]
connect_bd_intf_net -intf_net axi_cpu_interconnect_m00 [get_bd_intf_pins axi_cpu_interconnect/M00_AXI] [get_bd_intf_pins axi_iic_main/S_AXI]
connect_bd_intf_net -intf_net axi_mem_interconnect_m00 [get_bd_intf_pins axi_mem_interconnect/M00_AXI] [get_bd_intf_pins axi_ddr_cntrl/S_AXI]
connect_bd_intf_net -intf_net axi_mem_interconnect_s00 [get_bd_intf_pins axi_mem_interconnect/S00_AXI] [get_bd_intf_pins sys_mb/M_AXI_DC]
connect_bd_intf_net -intf_net axi_mem_interconnect_s01 [get_bd_intf_pins axi_mem_interconnect/S01_AXI] [get_bd_intf_pins sys_mb/M_AXI_IC]
connect_bd_intf_net -intf_net axi_cpu_interconnect_m01 [get_bd_intf_pins axi_cpu_interconnect/M01_AXI] [get_bd_intf_pins axi_hdmi_clkgen/s_axi]
connect_bd_intf_net -intf_net axi_cpu_interconnect_m02 [get_bd_intf_pins axi_cpu_interconnect/M02_AXI] [get_bd_intf_pins axi_hdmi_core/s_axi]
connect_bd_intf_net -intf_net axi_cpu_interconnect_m03 [get_bd_intf_pins axi_cpu_interconnect/M03_AXI] [get_bd_intf_pins axi_hdmi_dma/S_AXI_LITE]
connect_bd_intf_net -intf_net axi_mem_interconnect_s02 [get_bd_intf_pins axi_mem_interconnect/S02_AXI] [get_bd_intf_pins axi_hdmi_dma/M_AXI_MM2S]
connect_bd_intf_net -intf_net axi_cpu_interconnect_m04 [get_bd_intf_pins axi_cpu_interconnect/M04_AXI] [get_bd_intf_pins axi_spdif_tx_core/S_AXI]
connect_bd_intf_net -intf_net axi_cpu_interconnect_m05 [get_bd_intf_pins axi_cpu_interconnect/M05_AXI] [get_bd_intf_pins axi_spdif_tx_dma/S_AXI_LITE]
connect_bd_intf_net -intf_net axi_mem_interconnect_s03 [get_bd_intf_pins axi_mem_interconnect/S03_AXI] [get_bd_intf_pins axi_spdif_tx_dma/M_AXI_SG]
connect_bd_intf_net -intf_net axi_mem_interconnect_s04 [get_bd_intf_pins axi_mem_interconnect/S04_AXI] [get_bd_intf_pins axi_spdif_tx_dma/M_AXI_MM2S]
connect_bd_intf_net [get_bd_intf_pins axi_cpu_interconnect/M07_AXI] [get_bd_intf_pins axi_ad9361/s_axi]
connect_bd_intf_net [get_bd_intf_pins axi_cpu_interconnect/M08_AXI] [get_bd_intf_pins axi_ad9361_adc_dma/s_axi]
connect_bd_intf_net [get_bd_intf_pins axi_cpu_interconnect/M09_AXI] [get_bd_intf_pins axi_ad9361_dac_dma/s_axi]
connect_bd_intf_net [get_bd_intf_pins axi_cpu_interconnect/M10_AXI] [get_bd_intf_pins axi_fmcomms2_spi/AXI_LITE]
connect_bd_intf_net [get_bd_intf_pins axi_cpu_interconnect/M11_AXI] [get_bd_intf_pins axi_fmcomms2_gpio/S_AXI]
connect_bd_intf_net [get_bd_intf_pins axi_mem_interconnect/S08_AXI] [get_bd_intf_pins axi_ad9361_dac_dma/m_src_axi]
connect_bd_intf_net [get_bd_intf_pins axi_mem_interconnect/S09_AXI] [get_bd_intf_pins axi_ad9361_adc_dma/m_dest_axi]
connect_bd_intf_net [get_bd_intf_pins axi_cpu_aux_interconnect/M02_AXI] [get_bd_intf_pins AES_AXI_0/s00_axi]
connect_bd_intf_net [get_bd_intf_ports ddr3] [get_bd_intf_pins axi_ddr_cntrl/DDR3]
connect_bd_intf_net [get_bd_intf_ports mdio] [get_bd_intf_pins axi_ethernet/MDIO]
connect_bd_intf_net [get_bd_intf_ports mii] [get_bd_intf_pins axi_ethernet/MII]
connect_bd_intf_net [get_bd_intf_ports gpio_sw] [get_bd_intf_pins axi_gpio_sw_led/GPIO]
connect_bd_intf_net [get_bd_intf_ports gpio_led] [get_bd_intf_pins axi_gpio_sw_led/GPIO2]
connect_bd_intf_net [get_bd_intf_ports gpio_lcd] [get_bd_intf_pins axi_gpio_lcd/GPIO]
connect_bd_intf_net [get_bd_intf_ports iic_main] [get_bd_intf_pins axi_iic_main/IIC]
connect_bd_intf_net [get_bd_intf_ports linear_flash] [get_bd_intf_pins axi_linear_flash/EMC_INTF]
connect_bd_net -net mdm_1_debug_sys_rst [get_bd_pins sys_mb_debug/Debug_SYS_Rst] [get_bd_pins sys_rstgen/mb_debug_sys_rst]
connect_bd_net [get_bd_pins sys_rstgen/mb_reset] [get_bd_pins sys_mb/Reset]
connect_bd_net [get_bd_pins sys_rstgen/bus_struct_reset] \
  [get_bd_pins sys_dlmb/SYS_Rst] [get_bd_pins sys_ilmb/SYS_Rst] [get_bd_pins sys_dlmb_cntlr/LMB_Rst] \
  [get_bd_pins sys_ilmb_cntlr/LMB_Rst]
connect_bd_net -net sys_concat_intc_intr [get_bd_pins sys_concat_intc/dout] [get_bd_pins axi_intc/intr]
connect_bd_net [get_bd_pins axi_ddr_cntrl/mmcm_locked] [get_bd_pins sys_rstgen/dcm_locked] [get_bd_pins rst_axi_ddr_cntrl_200M/dcm_locked]
connect_bd_net -net sys_100m_resetn [get_bd_pins sys_rstgen/peripheral_aresetn] \
  [get_bd_pins axi_cpu_interconnect/M06_ARESETN] [get_bd_pins axi_cpu_aux_interconnect/ARESETN] \
  [get_bd_pins axi_cpu_interconnect/ARESETN] [get_bd_pins sys_mb_debug/S_AXI_ARESETN] [get_bd_pins axi_ddr_cntrl/aresetn] \
  [get_bd_pins axi_ethernet/s_axi_aresetn] [get_bd_pins axi_uart/s_axi_aresetn] [get_bd_pins axi_timer/s_axi_aresetn] \
  [get_bd_pins axi_intc/s_axi_aresetn] [get_bd_pins axi_gpio_lcd/s_axi_aresetn] [get_bd_pins axi_gpio_sw_led/s_axi_aresetn] \
  [get_bd_pins axi_iic_main/s_axi_aresetn] [get_bd_pins axi_cpu_aux_interconnect/S00_ARESETN] \
  [get_bd_pins axi_cpu_aux_interconnect/M00_ARESETN] [get_bd_pins axi_cpu_aux_interconnect/M01_ARESETN] \
  [get_bd_pins axi_cpu_aux_interconnect/M02_ARESETN] [get_bd_pins axi_cpu_aux_interconnect/M03_ARESETN] \
  [get_bd_pins axi_cpu_aux_interconnect/M04_ARESETN] [get_bd_pins axi_cpu_aux_interconnect/M05_ARESETN] \
  [get_bd_pins axi_cpu_aux_interconnect/M06_ARESETN] [get_bd_pins axi_cpu_aux_interconnect/M07_ARESETN] \
  [get_bd_pins axi_cpu_aux_interconnect/M08_ARESETN] [get_bd_pins axi_cpu_interconnect/S00_ARESETN] \
  [get_bd_pins axi_cpu_interconnect/M00_ARESETN] [get_bd_pins axi_mem_interconnect/S00_ARESETN] \
  [get_bd_pins axi_mem_interconnect/S01_ARESETN] [get_bd_pins axi_mem_interconnect/S05_ARESETN] \
  [get_bd_pins axi_mem_interconnect/S06_ARESETN] [get_bd_pins axi_mem_interconnect/S07_ARESETN] \
  [get_bd_pins axi_cpu_interconnect/M01_ARESETN] [get_bd_pins axi_cpu_interconnect/M02_ARESETN] \
  [get_bd_pins axi_cpu_interconnect/M03_ARESETN] [get_bd_pins axi_mem_interconnect/S02_ARESETN] \
  [get_bd_pins axi_hdmi_clkgen/s_axi_aresetn] [get_bd_pins axi_hdmi_core/s_axi_aresetn] [get_bd_pins axi_hdmi_dma/axi_resetn] \
  [get_bd_pins axi_cpu_interconnect/M04_ARESETN] [get_bd_pins axi_cpu_interconnect/M05_ARESETN] \
  [get_bd_pins axi_spdif_tx_core/S_AXI_ARESETN] [get_bd_pins axi_spdif_tx_core/S_AXIS_ARESETN] \
  [get_bd_pins axi_spdif_tx_dma/axi_resetn] [get_bd_pins axi_mem_interconnect/S03_ARESETN] \
  [get_bd_pins axi_mem_interconnect/S04_ARESETN] [get_bd_pins sys_audio_clkgen/resetn] \
  [get_bd_pins axi_linear_flash/s_axi_aresetn] [get_bd_pins axi_cpu_interconnect/M07_ARESETN] \
  [get_bd_pins axi_cpu_interconnect/M08_ARESETN] [get_bd_pins axi_cpu_interconnect/M09_ARESETN] \
  [get_bd_pins axi_ad9361/s_axi_aresetn] [get_bd_pins axi_ad9361_adc_dma/s_axi_aresetn] \
  [get_bd_pins axi_ad9361_dac_dma/s_axi_aresetn] [get_bd_pins axi_cpu_interconnect/M10_ARESETN] \
  [get_bd_pins axi_cpu_interconnect/M11_ARESETN] [get_bd_pins axi_fmcomms2_spi/s_axi_aresetn] \
  [get_bd_pins axi_fmcomms2_gpio/s_axi_aresetn] [get_bd_pins axi_mem_interconnect/S08_ARESETN] \
  [get_bd_pins axi_ad9361_dac_dma/m_src_axi_aresetn] [get_bd_pins axi_mem_interconnect/S09_ARESETN] \
  [get_bd_pins axi_ad9361_adc_dma/m_dest_axi_aresetn] [get_bd_pins sys_wfifo_0/rstn] [get_bd_pins sys_wfifo_1/rstn] \
  [get_bd_pins sys_wfifo_2/rstn] [get_bd_pins sys_wfifo_3/rstn] [get_bd_pins AES_AXI_0/s00_axi_aresetn]
connect_bd_net -net sys_200m_resetn [get_bd_pins sys_rstgen/interconnect_aresetn] \
  [get_bd_pins axi_mem_interconnect/ARESETN] [get_bd_pins axi_mem_interconnect/M00_ARESETN]
connect_bd_net -net sys_100m_clk [get_bd_pins axi_ddr_cntrl/ui_addn_clk_0] \
  [get_bd_pins axi_cpu_interconnect/M06_ACLK] [get_bd_pins axi_cpu_aux_interconnect/ACLK] \
  [get_bd_pins axi_cpu_interconnect/ACLK] [get_bd_pins sys_rstgen/slowest_sync_clk] [get_bd_pins sys_mb/Clk] \
  [get_bd_pins sys_mb_debug/S_AXI_ACLK] [get_bd_pins sys_dlmb/LMB_Clk] [get_bd_pins sys_ilmb/LMB_Clk] \
  [get_bd_pins sys_dlmb_cntlr/LMB_Clk] [get_bd_pins sys_ilmb_cntlr/LMB_Clk] [get_bd_pins axi_ethernet/s_axi_aclk] \
  [get_bd_pins axi_uart/s_axi_aclk] [get_bd_pins axi_timer/s_axi_aclk] [get_bd_pins axi_intc/s_axi_aclk] \
  [get_bd_pins axi_gpio_lcd/s_axi_aclk] [get_bd_pins axi_gpio_sw_led/s_axi_aclk] [get_bd_pins axi_iic_main/s_axi_aclk] \
  [get_bd_pins axi_cpu_aux_interconnect/S00_ACLK] [get_bd_pins axi_cpu_aux_interconnect/M00_ACLK] \
  [get_bd_pins axi_cpu_aux_interconnect/M01_ACLK] [get_bd_pins axi_cpu_aux_interconnect/M02_ACLK] \
  [get_bd_pins axi_cpu_aux_interconnect/M03_ACLK] [get_bd_pins axi_cpu_aux_interconnect/M04_ACLK] \
  [get_bd_pins axi_cpu_aux_interconnect/M05_ACLK] [get_bd_pins axi_cpu_aux_interconnect/M06_ACLK] \
  [get_bd_pins axi_cpu_aux_interconnect/M07_ACLK] [get_bd_pins axi_cpu_aux_interconnect/M08_ACLK] \
  [get_bd_pins axi_cpu_interconnect/S00_ACLK] [get_bd_pins axi_cpu_interconnect/M00_ACLK] \
  [get_bd_pins axi_mem_interconnect/S00_ACLK] [get_bd_pins axi_mem_interconnect/S01_ACLK] \
  [get_bd_pins axi_mem_interconnect/S05_ACLK] [get_bd_pins axi_mem_interconnect/S06_ACLK] \
  [get_bd_pins axi_mem_interconnect/S07_ACLK] [get_bd_pins axi_cpu_interconnect/M01_ACLK] \
  [get_bd_pins axi_cpu_interconnect/M02_ACLK] [get_bd_pins axi_cpu_interconnect/M03_ACLK] \
  [get_bd_pins axi_mem_interconnect/S02_ACLK] [get_bd_pins axi_hdmi_clkgen/s_axi_aclk] [get_bd_pins axi_hdmi_clkgen/drp_clk] \
  [get_bd_pins axi_hdmi_core/s_axi_aclk] [get_bd_pins axi_hdmi_core/m_axis_mm2s_clk] \
  [get_bd_pins axi_hdmi_dma/s_axi_lite_aclk] [get_bd_pins axi_hdmi_dma/m_axi_mm2s_aclk] \
  [get_bd_pins axi_hdmi_dma/m_axis_mm2s_aclk] [get_bd_pins axi_cpu_interconnect/M04_ACLK] \
  [get_bd_pins axi_cpu_interconnect/M05_ACLK] [get_bd_pins axi_spdif_tx_core/S_AXI_ACLK] \
  [get_bd_pins axi_spdif_tx_core/S_AXIS_ACLK] [get_bd_pins axi_spdif_tx_dma/s_axi_lite_aclk] \
  [get_bd_pins axi_spdif_tx_dma/m_axi_mm2s_aclk] [get_bd_pins axi_spdif_tx_dma/m_axi_sg_aclk] \
  [get_bd_pins axi_mem_interconnect/S03_ACLK] [get_bd_pins axi_mem_interconnect/S04_ACLK] \
  [get_bd_pins axi_linear_flash/s_axi_aclk] [get_bd_pins axi_linear_flash/rdclk] [get_bd_pins axi_cpu_interconnect/M07_ACLK] \
  [get_bd_pins axi_cpu_interconnect/M08_ACLK] [get_bd_pins axi_cpu_interconnect/M09_ACLK] [get_bd_pins axi_ad9361/s_axi_aclk] \
  [get_bd_pins axi_ad9361_adc_dma/s_axi_aclk] [get_bd_pins axi_ad9361_dac_dma/s_axi_aclk] \
  [get_bd_pins axi_cpu_interconnect/M10_ACLK] [get_bd_pins axi_cpu_interconnect/M11_ACLK] \
  [get_bd_pins axi_fmcomms2_spi/s_axi_aclk] [get_bd_pins axi_fmcomms2_spi/ext_spi_clk] \
  [get_bd_pins axi_fmcomms2_gpio/s_axi_aclk] [get_bd_pins AES_AXI_0/s00_axi_aclk]
connect_bd_net -net sys_200m_clk [get_bd_pins axi_ddr_cntrl/ui_clk] \
  [get_bd_pins axi_mem_interconnect/ACLK] [get_bd_pins axi_mem_interconnect/M00_ACLK] [get_bd_pins axi_hdmi_clkgen/clk] \
  [get_bd_pins sys_audio_clkgen/clk_in1] [get_bd_pins axi_ad9361/delay_clk] [get_bd_pins axi_mem_interconnect/S08_ACLK] \
  [get_bd_pins axi_ad9361_dac_dma/m_src_axi_aclk] [get_bd_pins axi_mem_interconnect/S09_ACLK] \
  [get_bd_pins axi_ad9361_adc_dma/m_dest_axi_aclk] [get_bd_pins ila_adc/clk] [get_bd_pins sys_wfifo_0/s_clk] \
  [get_bd_pins sys_wfifo_1/s_clk] [get_bd_pins sys_wfifo_2/s_clk] [get_bd_pins sys_wfifo_3/s_clk] \
  [get_bd_pins rst_axi_ddr_cntrl_200M/slowest_sync_clk] [get_bd_pins clk_wiz_0/clk_in1]
connect_bd_net [get_bd_pins axi_timer/interrupt] [get_bd_pins sys_concat_intc/In0]
connect_bd_net [get_bd_pins axi_ethernet/ip2intc_irpt] [get_bd_pins sys_concat_intc/In1]
connect_bd_net [get_bd_pins sys_const_gnd/dout] [get_bd_pins sys_concat_intc/In2] [get_bd_pins sys_concat_intc/In3]
connect_bd_net [get_bd_pins axi_uart/interrupt] [get_bd_pins sys_concat_intc/In4]
connect_bd_net [get_bd_pins axi_gpio_lcd/ip2intc_irpt] [get_bd_pins sys_concat_intc/In5]
connect_bd_net [get_bd_pins axi_gpio_sw_led/ip2intc_irpt] [get_bd_pins sys_concat_intc/In6]
connect_bd_net [get_bd_pins axi_spdif_tx_dma/mm2s_introut] [get_bd_pins sys_concat_intc/In7]
connect_bd_net [get_bd_pins axi_hdmi_dma/mm2s_introut] [get_bd_pins sys_concat_intc/In8]
connect_bd_net [get_bd_pins axi_iic_main/iic2intc_irpt] [get_bd_pins sys_concat_intc/In9]
connect_bd_net -net mb_intr_14_s [get_bd_ports mb_intr_14] [get_bd_pins sys_concat_intc/In14]
connect_bd_net -net mb_intr_15_s [get_bd_ports mb_intr_15] [get_bd_pins sys_concat_intc/In15]
connect_bd_net -net mb_intr_16_s [get_bd_ports mb_intr_16] [get_bd_pins sys_concat_intc/In16]
connect_bd_net -net mb_intr_17_s [get_bd_ports mb_intr_17] [get_bd_pins sys_concat_intc/In17]
connect_bd_net -net mb_intr_18_s [get_bd_ports mb_intr_18] [get_bd_pins sys_concat_intc/In18]
connect_bd_net -net mb_intr_19_s [get_bd_ports mb_intr_19] [get_bd_pins sys_concat_intc/In19]
connect_bd_net -net mb_intr_20_s [get_bd_ports mb_intr_20] [get_bd_pins sys_concat_intc/In20]
connect_bd_net -net mb_intr_21_s [get_bd_ports mb_intr_21] [get_bd_pins sys_concat_intc/In21]
connect_bd_net -net mb_intr_22_s [get_bd_ports mb_intr_22] [get_bd_pins sys_concat_intc/In22]
connect_bd_net -net mb_intr_23_s [get_bd_ports mb_intr_23] [get_bd_pins sys_concat_intc/In23]
connect_bd_net -net mb_intr_24_s [get_bd_ports mb_intr_24] [get_bd_pins sys_concat_intc/In24]
connect_bd_net -net mb_intr_25_s [get_bd_ports mb_intr_25] [get_bd_pins sys_concat_intc/In25]
connect_bd_net -net mb_intr_26_s [get_bd_ports mb_intr_26] [get_bd_pins sys_concat_intc/In26]
connect_bd_net -net mb_intr_27_s [get_bd_ports mb_intr_27] [get_bd_pins sys_concat_intc/In27]
connect_bd_net -net mb_intr_28_s [get_bd_ports mb_intr_28] [get_bd_pins sys_concat_intc/In28]
connect_bd_net -net mb_intr_29_s [get_bd_ports mb_intr_29] [get_bd_pins sys_concat_intc/In29]
connect_bd_net -net mb_intr_30_s [get_bd_ports mb_intr_30] [get_bd_pins sys_concat_intc/In30]
connect_bd_net -net mb_intr_31_s [get_bd_ports mb_intr_31] [get_bd_pins sys_concat_intc/In31]
connect_bd_net -net sys_const_vcc_vcc [get_bd_pins sys_const_vcc/dout] [get_bd_ports fan_pwm] [get_bd_ports iic_rstn]
connect_bd_net -net sys_rst_s [get_bd_ports sys_rst] [get_bd_pins sys_rstgen/ext_reset_in] [get_bd_pins axi_ddr_cntrl/sys_rst]
connect_bd_net -net sys_clk_p_s [get_bd_ports sys_clk_p] [get_bd_pins axi_ddr_cntrl/sys_clk_p]
connect_bd_net -net sys_clk_n_s [get_bd_ports sys_clk_n] [get_bd_pins axi_ddr_cntrl/sys_clk_n]
connect_bd_net -net sys_const_ddr3_0_const [get_bd_pins sys_const_ddr3_0/dout] [get_bd_ports ddr3_1_n]
connect_bd_net -net sys_const_ddr3_1_const [get_bd_pins sys_const_ddr3_1/dout] [get_bd_ports ddr3_1_p]
connect_bd_net -net axi_uart_sin [get_bd_ports uart_sin] [get_bd_pins axi_uart/rx]
connect_bd_net -net axi_uart_sout [get_bd_pins axi_uart/tx] [get_bd_ports uart_sout]
connect_bd_net -net axi_hdmi_tx_core_hdmi_clk [get_bd_pins axi_hdmi_clkgen/clk_0] [get_bd_pins axi_hdmi_core/hdmi_clk]
connect_bd_net -net axi_hdmi_tx_core_hdmi_out_clk [get_bd_pins axi_hdmi_core/hdmi_out_clk] [get_bd_ports hdmi_out_clk]
connect_bd_net -net axi_hdmi_tx_core_hdmi_hsync [get_bd_pins axi_hdmi_core/hdmi_16_hsync] [get_bd_ports hdmi_hsync]
connect_bd_net -net axi_hdmi_tx_core_hdmi_vsync [get_bd_pins axi_hdmi_core/hdmi_16_vsync] [get_bd_ports hdmi_vsync]
connect_bd_net -net axi_hdmi_tx_core_hdmi_data_e [get_bd_pins axi_hdmi_core/hdmi_16_data_e] [get_bd_ports hdmi_data_e]
connect_bd_net -net axi_hdmi_tx_core_hdmi_data [get_bd_pins axi_hdmi_core/hdmi_16_data] [get_bd_ports hdmi_data]
connect_bd_net -net axi_hdmi_tx_core_mm2s_tvalid [get_bd_pins axi_hdmi_dma/m_axis_mm2s_tvalid] [get_bd_pins axi_hdmi_core/m_axis_mm2s_tvalid]
connect_bd_net -net axi_hdmi_tx_core_mm2s_tdata [get_bd_pins axi_hdmi_dma/m_axis_mm2s_tdata] [get_bd_pins axi_hdmi_core/m_axis_mm2s_tdata]
connect_bd_net -net axi_hdmi_tx_core_mm2s_tkeep [get_bd_pins axi_hdmi_dma/m_axis_mm2s_tkeep] [get_bd_pins axi_hdmi_core/m_axis_mm2s_tkeep]
connect_bd_net -net axi_hdmi_tx_core_mm2s_tlast [get_bd_pins axi_hdmi_dma/m_axis_mm2s_tlast] [get_bd_pins axi_hdmi_core/m_axis_mm2s_tlast]
connect_bd_net -net axi_hdmi_tx_core_mm2s_tready [get_bd_pins axi_hdmi_core/m_axis_mm2s_tready] [get_bd_pins axi_hdmi_dma/m_axis_mm2s_tready]
connect_bd_net -net axi_hdmi_tx_core_mm2s_fsync [get_bd_pins axi_hdmi_core/m_axis_mm2s_fsync] \
  [get_bd_pins axi_hdmi_dma/mm2s_fsync] [get_bd_pins axi_hdmi_core/m_axis_mm2s_fsync_ret]
connect_bd_net -net axi_spdif_tx_dma_mm2s_valid [get_bd_pins axi_spdif_tx_dma/m_axis_mm2s_tvalid] [get_bd_pins axi_spdif_tx_core/S_AXIS_TVALID]
connect_bd_net -net axi_spdif_tx_dma_mm2s_data [get_bd_pins axi_spdif_tx_dma/m_axis_mm2s_tdata] [get_bd_pins axi_spdif_tx_core/S_AXIS_TDATA]
connect_bd_net -net axi_spdif_tx_dma_mm2s_last [get_bd_pins axi_spdif_tx_dma/m_axis_mm2s_tlast] [get_bd_pins axi_spdif_tx_core/S_AXIS_TLAST]
connect_bd_net -net axi_spdif_tx_dma_mm2s_ready [get_bd_pins axi_spdif_tx_core/S_AXIS_TREADY] [get_bd_pins axi_spdif_tx_dma/m_axis_mm2s_tready]
connect_bd_net -net sys_audio_clkgen_clk [get_bd_pins sys_audio_clkgen/clk_out1] [get_bd_pins axi_spdif_tx_core/spdif_data_clk]
connect_bd_net -net spdif_s [get_bd_pins axi_spdif_tx_core/spdif_tx_o] [get_bd_ports spdif]
connect_bd_net [get_bd_ports spi_csn_i] [get_bd_pins axi_fmcomms2_spi/ss_i]
connect_bd_net -net spi_csn_o [get_bd_pins axi_fmcomms2_spi/ss_o] [get_bd_ports spi_csn_o]
connect_bd_net [get_bd_ports spi_sclk_i] [get_bd_pins axi_fmcomms2_spi/sck_i]
connect_bd_net -net spi_sclk_o [get_bd_pins axi_fmcomms2_spi/sck_o] [get_bd_ports spi_sclk_o]
connect_bd_net [get_bd_ports spi_mosi_i] [get_bd_pins axi_fmcomms2_spi/io0_i]
connect_bd_net -net spi_mosi_o [get_bd_pins axi_fmcomms2_spi/io0_o] [get_bd_ports spi_mosi_o]
connect_bd_net [get_bd_ports spi_miso_i] [get_bd_pins axi_fmcomms2_spi/io1_i]
connect_bd_net [get_bd_ports gpio_fmcomms2_i] [get_bd_pins axi_fmcomms2_gpio/gpio_io_i]
connect_bd_net -net gpio_fmcomms2_o [get_bd_pins axi_fmcomms2_gpio/gpio_io_o] [get_bd_ports gpio_fmcomms2_o]
connect_bd_net -net gpio_fmcomms2_t [get_bd_pins axi_fmcomms2_gpio/gpio_io_t] [get_bd_ports gpio_fmcomms2_t]
connect_bd_net -net axi_ad9361_clk [get_bd_pins axi_ad9361/l_clk] \
  [get_bd_pins axi_ad9361/clk] [get_bd_pins axi_ad9361_adc_dma/fifo_wr_clk] [get_bd_pins axi_ad9361_dac_dma/fifo_rd_clk] \
  [get_bd_pins util_adc_pack/clk] [get_bd_pins util_dac_unpack/clk] [get_bd_pins sys_wfifo_0/m_clk] \
  [get_bd_pins sys_wfifo_1/m_clk] [get_bd_pins sys_wfifo_2/m_clk] [get_bd_pins sys_wfifo_3/m_clk]
connect_bd_net -net axi_ad9361_rx_clk_in_p [get_bd_ports rx_clk_in_p] [get_bd_pins axi_ad9361/rx_clk_in_p]
connect_bd_net -net axi_ad9361_rx_clk_in_n [get_bd_ports rx_clk_in_n] [get_bd_pins axi_ad9361/rx_clk_in_n]
connect_bd_net -net axi_ad9361_rx_frame_in_p [get_bd_ports rx_frame_in_p] [get_bd_pins axi_ad9361/rx_frame_in_p]
connect_bd_net -net axi_ad9361_rx_frame_in_n [get_bd_ports rx_frame_in_n] [get_bd_pins axi_ad9361/rx_frame_in_n]
connect_bd_net -net axi_ad9361_rx_data_in_p [get_bd_ports rx_data_in_p] [get_bd_pins axi_ad9361/rx_data_in_p]
connect_bd_net -net axi_ad9361_rx_data_in_n [get_bd_ports rx_data_in_n] [get_bd_pins axi_ad9361/rx_data_in_n]
connect_bd_net [get_bd_pins axi_ad9361/tx_clk_out_p] [get_bd_ports tx_clk_out_p]
connect_bd_net [get_bd_pins axi_ad9361/tx_clk_out_n] [get_bd_ports tx_clk_out_n]
connect_bd_net [get_bd_pins axi_ad9361/tx_frame_out_p] [get_bd_ports tx_frame_out_p]
connect_bd_net [get_bd_pins axi_ad9361/tx_frame_out_n] [get_bd_ports tx_frame_out_n]
connect_bd_net [get_bd_pins axi_ad9361/tx_data_out_p] [get_bd_ports tx_data_out_p]
connect_bd_net [get_bd_pins axi_ad9361/tx_data_out_n] [get_bd_ports tx_data_out_n]
connect_bd_net [get_bd_pins axi_ad9361/adc_valid_i0] [get_bd_pins util_adc_pack/chan_valid_0] [get_bd_pins sys_wfifo_0/m_wr]
connect_bd_net [get_bd_pins axi_ad9361/adc_valid_q0] [get_bd_pins util_adc_pack/chan_valid_1] [get_bd_pins sys_wfifo_1/m_wr]
connect_bd_net [get_bd_pins axi_ad9361/adc_valid_i1] [get_bd_pins util_adc_pack/chan_valid_2] [get_bd_pins sys_wfifo_2/m_wr]
connect_bd_net [get_bd_pins axi_ad9361/adc_valid_q1] [get_bd_pins util_adc_pack/chan_valid_3] [get_bd_pins sys_wfifo_3/m_wr]
connect_bd_net [get_bd_pins axi_ad9361/adc_enable_i0] [get_bd_pins util_adc_pack/chan_enable_0]
connect_bd_net [get_bd_pins axi_ad9361/adc_enable_q0] [get_bd_pins util_adc_pack/chan_enable_1]
connect_bd_net [get_bd_pins axi_ad9361/adc_enable_i1] [get_bd_pins util_adc_pack/chan_enable_2]
connect_bd_net [get_bd_pins axi_ad9361/adc_enable_q1] [get_bd_pins util_adc_pack/chan_enable_3]
connect_bd_net -net axi_ad9361_adc_chan_i0 [get_bd_pins axi_ad9361/adc_data_i0] \
  [get_bd_pins util_adc_pack/chan_data_0] [get_bd_pins sys_wfifo_0/m_wdata]
connect_bd_net -net axi_ad9361_adc_chan_q0 [get_bd_pins axi_ad9361/adc_data_q0] \
  [get_bd_pins util_adc_pack/chan_data_1] [get_bd_pins sys_wfifo_1/m_wdata]
connect_bd_net -net axi_ad9361_adc_chan_i1 [get_bd_pins axi_ad9361/adc_data_i1] \
  [get_bd_pins util_adc_pack/chan_data_2] [get_bd_pins sys_wfifo_2/m_wdata]
connect_bd_net -net axi_ad9361_adc_chan_q1 [get_bd_pins axi_ad9361/adc_data_q1] \
  [get_bd_pins util_adc_pack/chan_data_3] [get_bd_pins sys_wfifo_3/m_wdata]
connect_bd_net [get_bd_pins util_adc_pack/dvalid] [get_bd_pins axi_ad9361_adc_dma/fifo_wr_en]
connect_bd_net [get_bd_pins util_adc_pack/dsync] [get_bd_pins axi_ad9361_adc_dma/fifo_wr_sync]
connect_bd_net [get_bd_pins util_adc_pack/ddata] [get_bd_pins axi_ad9361_adc_dma/fifo_wr_din]
connect_bd_net -net axi_ad9361_adc_dovf [get_bd_pins axi_ad9361_adc_dma/fifo_wr_overflow] [get_bd_pins axi_ad9361/adc_dovf]
connect_bd_net -net axi_ad9361_dac_valid_0 [get_bd_pins axi_ad9361/dac_valid_i0] [get_bd_pins util_dac_unpack/dac_valid_00]
connect_bd_net -net axi_ad9361_dac_valid_1 [get_bd_pins axi_ad9361/dac_valid_q0] [get_bd_pins util_dac_unpack/dac_valid_01]
connect_bd_net -net axi_ad9361_dac_valid_2 [get_bd_pins axi_ad9361/dac_valid_i1] [get_bd_pins util_dac_unpack/dac_valid_02]
connect_bd_net -net axi_ad9361_dac_valid_3 [get_bd_pins axi_ad9361/dac_valid_q1] [get_bd_pins util_dac_unpack/dac_valid_03]
connect_bd_net -net axi_ad9361_dac_enable_0 [get_bd_pins axi_ad9361/dac_enable_i0] [get_bd_pins util_dac_unpack/dac_enable_00]
connect_bd_net -net axi_ad9361_dac_enable_1 [get_bd_pins axi_ad9361/dac_enable_q0] [get_bd_pins util_dac_unpack/dac_enable_01]
connect_bd_net -net axi_ad9361_dac_enable_2 [get_bd_pins axi_ad9361/dac_enable_i1] [get_bd_pins util_dac_unpack/dac_enable_02]
connect_bd_net -net axi_ad9361_dac_enable_3 [get_bd_pins axi_ad9361/dac_enable_q1] [get_bd_pins util_dac_unpack/dac_enable_03]
connect_bd_net -net axi_ad9361_dac_data_0 [get_bd_pins util_dac_unpack/dac_data_00] [get_bd_pins axi_ad9361/dac_data_i0]
connect_bd_net -net axi_ad9361_dac_data_1 [get_bd_pins util_dac_unpack/dac_data_01] [get_bd_pins axi_ad9361/dac_data_q0]
connect_bd_net -net axi_ad9361_dac_data_2 [get_bd_pins util_dac_unpack/dac_data_02] [get_bd_pins axi_ad9361/dac_data_i1]
connect_bd_net -net axi_ad9361_dac_data_3 [get_bd_pins util_dac_unpack/dac_data_03] [get_bd_pins axi_ad9361/dac_data_q1]
connect_bd_net -net fifo_data [get_bd_pins axi_ad9361_dac_dma/fifo_rd_dout] [get_bd_pins util_dac_unpack/dma_data]
connect_bd_net -net fifo_valid [get_bd_pins axi_ad9361_dac_dma/fifo_rd_valid] [get_bd_pins util_dac_unpack/fifo_valid]
connect_bd_net -net axi_ad9361_dac_drd [get_bd_pins util_dac_unpack/dma_rd] [get_bd_pins axi_ad9361_dac_dma/fifo_rd_en]
connect_bd_net -net axi_ad9361_dac_dunf [get_bd_pins axi_ad9361_dac_dma/fifo_rd_underflow] [get_bd_pins axi_ad9361/dac_dunf]
connect_bd_net -net axi_fmcomms2_spi_irq [get_bd_pins axi_fmcomms2_spi/ip2intc_irpt] [get_bd_pins sys_concat_intc/In10]
connect_bd_net -net axi_fmcomms2_gpio_irq [get_bd_pins axi_fmcomms2_gpio/ip2intc_irpt] [get_bd_pins sys_concat_intc/In11]
connect_bd_net [get_bd_pins axi_ad9361_adc_dma/irq] [get_bd_pins sys_concat_intc/In12]
connect_bd_net [get_bd_pins axi_ad9361_dac_dma/irq] [get_bd_pins sys_concat_intc/In13]
connect_bd_net -net util_wfifo_0_s_wr [get_bd_pins sys_wfifo_0/s_wr] [get_bd_pins ila_adc/probe0]
connect_bd_net -net util_wfifo_1_s_wr [get_bd_pins sys_wfifo_1/s_wr] [get_bd_pins ila_adc/probe1]
connect_bd_net -net util_wfifo_2_s_wr [get_bd_pins sys_wfifo_2/s_wr] [get_bd_pins ila_adc/probe2]
connect_bd_net -net util_wfifo_3_s_wr [get_bd_pins sys_wfifo_3/s_wr] [get_bd_pins ila_adc/probe3]
connect_bd_net -net util_wfifo_0_s_wdata [get_bd_pins sys_wfifo_0/s_wdata] [get_bd_pins ila_adc/probe4]
connect_bd_net -net util_wfifo_1_s_wdata [get_bd_pins sys_wfifo_1/s_wdata] [get_bd_pins ila_adc/probe5]
connect_bd_net -net util_wfifo_2_s_wdata [get_bd_pins sys_wfifo_2/s_wdata] [get_bd_pins ila_adc/probe6]
connect_bd_net -net util_wfifo_3_s_wdata [get_bd_pins sys_wfifo_3/s_wdata] [get_bd_pins ila_adc/probe7]
connect_bd_net [get_bd_pins axi_ddr_cntrl/ui_clk_sync_rst] [get_bd_pins rst_axi_ddr_cntrl_200M/ext_reset_in]
connect_bd_net [get_bd_ports reset] [get_bd_pins clk_wiz_0/reset]
connect_bd_net [get_bd_pins clk_wiz_0/clk_out1] [get_bd_pins AES_AXI_0/aes_clk]
